# EAGLE design Vision (EAGLE 8.1.0)

## Sheet 1 of 3
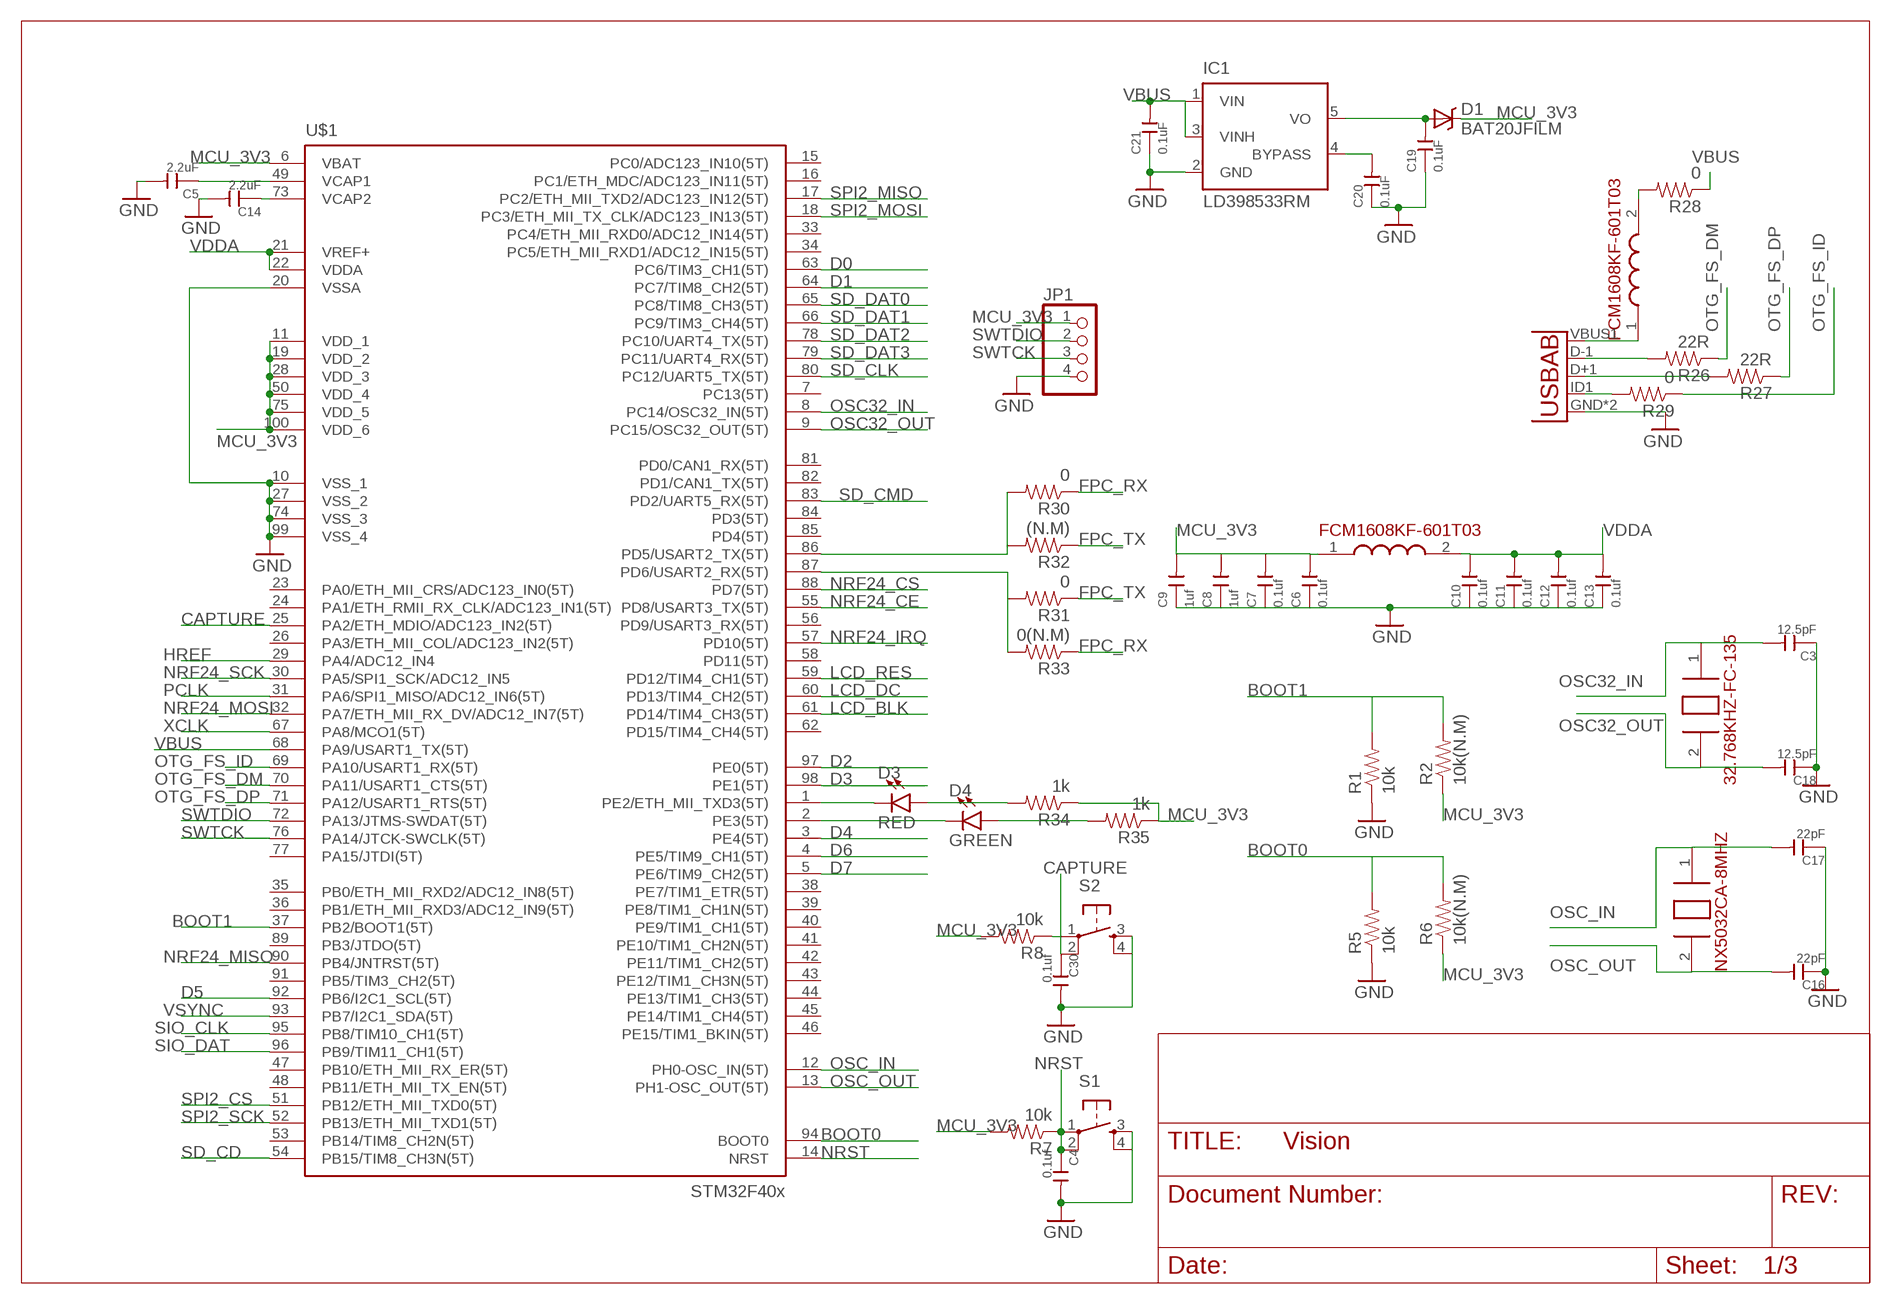
[diagram p0: schematic, sheet 1]

### Parts
C3  12.5pF  CERAMIC-4.7UF-10V-10%-X5R(0603)  [C0603]
C4  0.1uf  CERAMIC-4.7UF-10V-10%-X5R(0603)  [C0603]
C5  2.2uF  CERAMIC-0.5PF-50V-0.1PF-NPO(0603)  [C0603]
C6  0.1uf  CERAMIC-4.7UF-10V-10%-X5R(0603)  [C0603]
C7  0.1uf  CERAMIC-4.7UF-10V-10%-X5R(0603)  [C0603]
C8  1uf  CERAMIC-4.7UF-10V-10%-X5R(0603)  [C0603]
C9  1uf  CERAMIC-4.7UF-10V-10%-X5R(0603)  [C0603]
C10  0.1uf  CERAMIC-4.7UF-10V-10%-X5R(0603)  [C0603]
C11  0.1uf  CERAMIC-4.7UF-10V-10%-X5R(0603)  [C0603]
C12  0.1uf  CERAMIC-4.7UF-10V-10%-X5R(0603)  [C0603]
C13  0.1uf  CERAMIC-4.7UF-10V-10%-X5R(0603)  [C0603]
C14  2.2uF  CERAMIC-0.5PF-50V-0.1PF-NPO(0603)  [C0603]
C16  22pF  CERAMIC-4.7UF-10V-10%-X5R(0603)  [C0603]
C17  22pF  CERAMIC-4.7UF-10V-10%-X5R(0603)  [C0603]
C18  12.5pF  CERAMIC-4.7UF-10V-10%-X5R(0603)  [C0603]
C19  0.1uF  CERAMIC-0.5PF-50V-0.1PF-NPO(0603)  [C0603]
C20  0.1uF  CERAMIC-0.5PF-50V-0.1PF-NPO(0603)  [C0603]
C21  0.1uF  CERAMIC-0.5PF-50V-0.1PF-NPO(0603)  [C0603]
C30  0.1uf  CERAMIC-4.7UF-10V-10%-X5R(0603)  [C0603]
D1  BAT20JFILM  [SOD-323]
D3  RED  LED-BLUE0603  [LED-0603]
D4  GREEN  LED-BLUE0603  [LED-0603]
IC1  LD398533RM  [SOT23-5L]
JP1  PINHD-1X4  [1X04]
R1  10k  0OHM1/10W5%(0603)  [0603]
R2  10k(N.M)  0OHM1/10W5%(0603)  [0603]
R5  10k  0OHM1/10W5%(0603)  [0603]
R6  10k(N.M)  0OHM1/10W5%(0603)  [0603]
R7  10k  0OHM1/10W5%(0603)  [0603]
R8  10k  0OHM1/10W5%(0603)  [0603]
R26  22R  390OHM1/10W1%(0603)  [0603-RES]
R27  22R  390OHM1/10W1%(0603)  [0603-RES]
R28  0  390OHM1/10W1%(0603)  [0603-RES]
R29  0  390OHM1/10W1%(0603)  [0603-RES]
R30  0  0OHM1/10W5%(0603)  [0603]
R31  0  0OHM1/10W5%(0603)  [0603]
R32  (N.M)  0OHM1/10W5%(0603)  [0603]
R33  0(N.M)  0OHM1/10W5%(0603)  [0603]
R34  1k  0OHM1/10W5%(0603)  [0603]
R35  1k  0OHM1/10W5%(0603)  [0603]
S1  TAC_SWITCHSMD  [TACTILE_SWITCH_SMD]
S2  TAC_SWITCHSMD  [TACTILE_SWITCH_SMD]
U4  USB""  [USB-MICRO-SMD]
U$1  STM32F407V  [TQFP100]
U$2  NX5032CA-8MHZ  [NX5032CA-8MHZ]
U$3  FCM1608KF-601T03  [FCM1608KF-601T03]
U$4  32.768KHZ-FC-135  [32.768KHZ-FC-135]
U$5  FCM1608KF-601T03  [FCM1608KF-601T03]

### Nets
BOOT0: R5.2 R6.2 U$1.94(BOOT0)
BOOT1: R1.2 R2.2 U$1.37(PB2/BOOT1(5T))
CAPTURE: C30.1 R8.1 S2.1 S2.2 U$1.25(PA2/ETH_MDIO/ADC123_IN2(5T))
D0: U$1.63(PC6/TIM3_CH1(5T)) ; also sheet 2
D1: U$1.64(PC7/TIM8_CH2(5T)) ; also sheet 2
D2: U$1.97(PE0(5T)) ; also sheet 2
D3: U$1.98(PE1(5T)) ; also sheet 2
D4: U$1.3(PE4(5T)) ; also sheet 2
D5: U$1.92(PB6/I2C1_SCL(5T)) ; also sheet 2
D6: U$1.4(PE5/TIM9_CH1(5T)) ; also sheet 2
D7: U$1.5(PE6/TIM9_CH2(5T)) ; also sheet 2
FPC_RX: R30.1 R33.1 ; also sheet 3
FPC_TX: R31.1 R32.1 ; also sheet 3
GND: C3.1 C4.2 C5.2 C6.1 C7.1 C8.1 C9.1 C10.1 C11.1 C12.1 C13.1 C14.2 C16.1 C17.1 C18.1 C19.1 C20.1 C21.1 C30.2 IC1.2(GND) JP1.4 R1.1 R5.1 S1.3 S1.4 S2.3 S2.4 U4.GND U4.GND1(GND) U$1.10(VSS_1) U$1.20(VSSA) U$1.27(VSS_2) U$1.74(VSS_3) U$1.99(VSS_4) ; also sheet 2,3
HREF: U$1.29(PA4/ADC12_IN4) ; also sheet 2
LCD_BLK: U$1.61(PD14/TIM4_CH3(5T)) ; also sheet 3
LCD_DC: U$1.60(PD13/TIM4_CH2(5T)) ; also sheet 3
LCD_RES: U$1.59(PD12/TIM4_CH1(5T)) ; also sheet 3
MCU_3V3: C6.2 C7.2 C8.2 C9.2 D1.1(C) JP1.1 R2.1 R6.1 R7.2 R8.2 R34.1 R35.1 U$1.6(VBAT) U$1.11(VDD_1) U$1.19(VDD_2) U$1.28(VDD_3) U$1.50(VDD_4) U$1.75(VDD_5) U$1.100(VDD_6) U$3.1(1.IN) ; also sheet 2,3
N$2: D3.C U$1.1(PE2/ETH_MII_TXD3(5T))
N$3: D4.C U$1.2(PE3(5T))
N$10: D3.A R34.2
N$11: C5.1 U$1.49(VCAP1)
N$12: C14.1 U$1.73(VCAP2)
N$14: D4.A R35.2
N$18: C20.2 IC1.4(BYPASS)
N$25: R26.2 U4.D-1(D-)
N$30: C19.2 D1.2(A) IC1.5(VO)
N$31: R27.2 U4.D+1(D+)
N$32: U4.VBUS1(VBUS) U$5.1(1.IN)
N$33: R29.2 U4.ID1(USBID)
N$34: R28.2 U$5.2(2.OUT)
NRF24_CE: U$1.55(PD8/USART3_TX(5T)) ; also sheet 3
NRF24_CS: U$1.88(PD7(5T)) ; also sheet 3
NRF24_IRQ: U$1.57(PD10(5T)) ; also sheet 3
NRF24_MISO: U$1.90(PB4/JNTRST(5T)) ; also sheet 3
NRF24_MOSI: U$1.32(PA7/ETH_MII_RX_DV/ADC12_IN7(5T)) ; also sheet 3
NRF24_SCK: U$1.30(PA5/SPI1_SCK/ADC12_IN5) ; also sheet 3
NRST: C4.1 R7.1 S1.1 S1.2 U$1.14(NRST)
OSC32_IN: C3.2 U$1.8(PC14/OSC32_IN(5T)) U$4.1(1.XIN)
OSC32_OUT: C18.2 U$1.9(PC15/OSC32_OUT(5T)) U$4.2(2.XIN)
OSC_IN: C17.2 U$1.12(PH0-OSC_IN(5T)) U$2.1(1.XIN)
OSC_OUT: C16.2 U$1.13(PH1-OSC_OUT(5T)) U$2.2(2.XOUT)
OTG_FS_DM: R26.1 U$1.70(PA11/USART1_CTS(5T))
OTG_FS_DP: R27.1 U$1.71(PA12/USART1_RTS(5T))
OTG_FS_ID: R29.1 U$1.69(PA10/USART1_RX(5T))
PCLK: U$1.31(PA6/SPI1_MISO/ADC12_IN6(5T)) ; also sheet 2
SD_CD: U$1.54(PB15/TIM8_CH3N(5T)) ; also sheet 3
SD_CLK: U$1.80(PC12/UART5_TX(5T)) ; also sheet 3
SD_CMD: U$1.83(PD2/UART5_RX(5T)) ; also sheet 3
SD_DAT0: U$1.65(PC8/TIM8_CH3(5T)) ; also sheet 3
SD_DAT1: U$1.66(PC9/TIM3_CH4(5T)) ; also sheet 3
SD_DAT2: U$1.78(PC10/UART4_TX(5T)) ; also sheet 3
SD_DAT3: U$1.79(PC11/UART4_RX(5T)) ; also sheet 3
SIO_CLK: U$1.95(PB8/TIM10_CH1(5T)) ; also sheet 2
SIO_DAT: U$1.96(PB9/TIM11_CH1(5T)) ; also sheet 2
SPI2_CS: U$1.51(PB12/ETH_MII_TXD0(5T)) ; also sheet 3
SPI2_MISO: U$1.17(PC2/ETH_MII_TXD2/ADC123_IN12(5T)) ; also sheet 3
SPI2_MOSI: U$1.18(PC3/ETH_MII_TX_CLK/ADC123_IN13(5T)) ; also sheet 3
SPI2_SCK: U$1.52(PB13/ETH_MII_TXD1(5T)) ; also sheet 3
SWTCK: JP1.3 U$1.76(PA14/JTCK-SWCLK(5T))
SWTDIO: JP1.2 U$1.72(PA13/JTMS-SWDAT(5T))
UART2_RX: R31.2 R33.2 U$1.87(PD6/USART2_RX(5T))
UART2_TX: R30.2 R32.2 U$1.86(PD5/USART2_TX(5T))
VBUS: C21.2 IC1.1(VIN) IC1.3(VINH) R28.1 U$1.68(PA9/USART1_TX(5T))
VDDA: C10.2 C11.2 C12.2 C13.2 U$1.21(VREF+) U$1.22(VDDA) U$3.2(2.OUT)
VSYNC: U$1.93(PB7/I2C1_SDA(5T)) ; also sheet 2
XCLK: U$1.67(PA8/MCO1(5T)) ; also sheet 2
Unconnected: U$1.7(PC13(5T)) U$1.15(PC0/ADC123_IN10(5T)) U$1.16(PC1/ETH_MDC/ADC123_IN11(5T)) U$1.23(PA0/ETH_MII_CRS/ADC123_IN0(5T)) U$1.24(PA1/ETH_RMII_RX_CLK/ADC123_IN1(5T)) U$1.26(PA3/ETH_MII_COL/ADC123_IN2(5T)) U$1.33(PC4/ETH_MII_RXD0/ADC12_IN14(5T)) U$1.34(PC5/ETH_MII_RXD1/ADC12_IN15(5T)) U$1.35(PB0/ETH_MII_RXD2/ADC12_IN8(5T)) U$1.36(PB1/ETH_MII_RXD3/ADC12_IN9(5T)) U$1.38(PE7/TIM1_ETR(5T)) U$1.39(PE8/TIM1_CH1N(5T)) U$1.40(PE9/TIM1_CH1(5T)) U$1.41(PE10/TIM1_CH2N(5T)) U$1.42(PE11/TIM1_CH2(5T)) U$1.43(PE12/TIM1_CH3N(5T)) U$1.44(PE13/TIM1_CH3(5T)) U$1.45(PE14/TIM1_CH4(5T)) U$1.46(PE15/TIM1_BKIN(5T)) U$1.47(PB10/ETH_MII_RX_ER(5T)) U$1.48(PB11/ETH_MII_TX_EN(5T)) U$1.53(PB14/TIM8_CH2N(5T)) U$1.56(PD9/USART3_RX(5T)) U$1.58(PD11(5T)) U$1.62(PD15/TIM4_CH4(5T)) U$1.77(PA15/JTDI(5T)) U$1.81(PD0/CAN1_RX(5T)) U$1.82(PD1/CAN1_TX(5T)) U$1.84(PD3(5T)) U$1.85(PD4(5T)) U$1.89(PB3/JTDO(5T)) U$1.91(PB5/TIM3_CH2(5T))

## Sheet 2 of 3
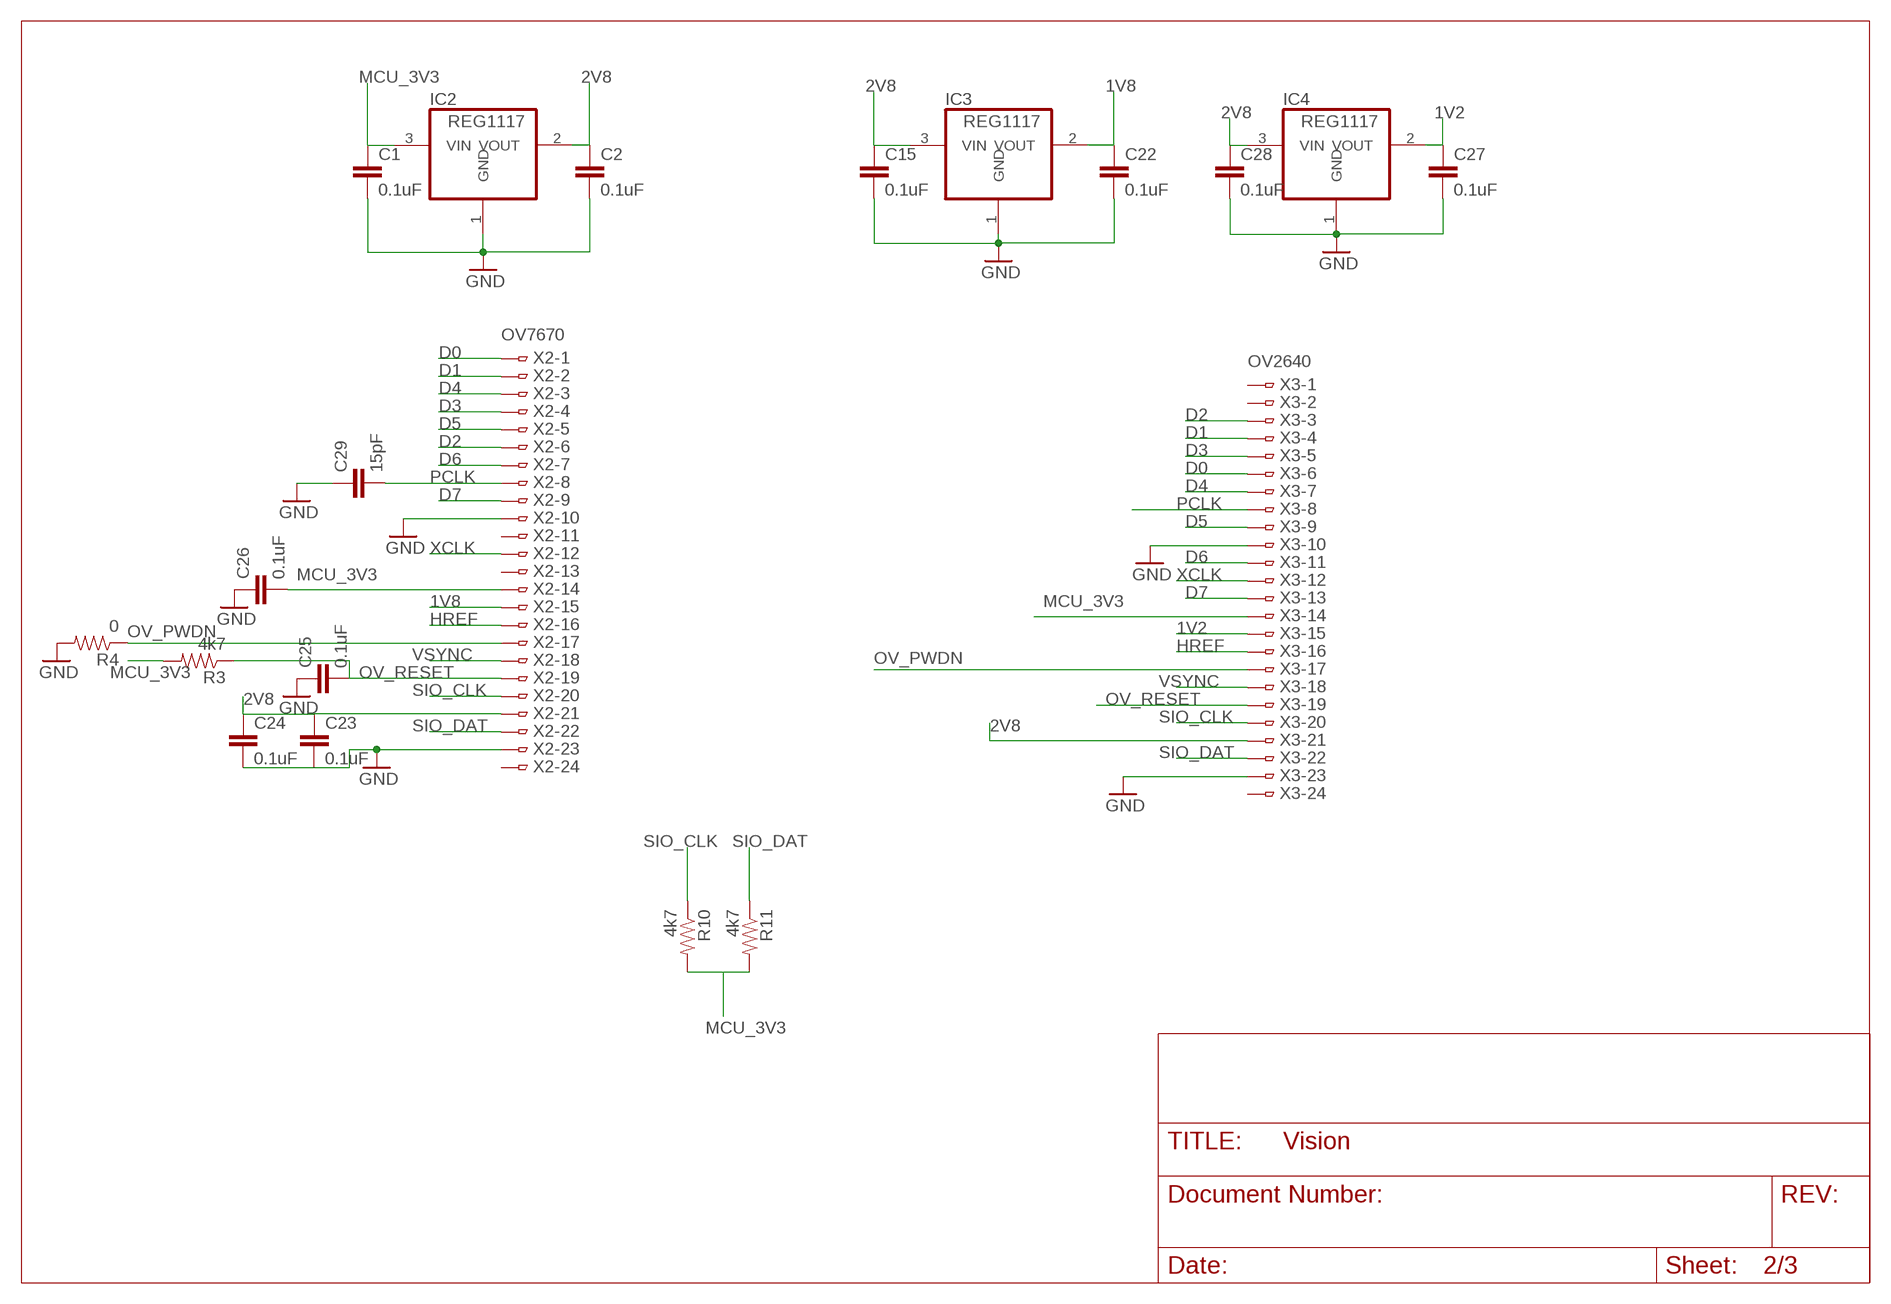
[diagram p1: schematic, sheet 2]

### Parts
C1  0.1uF  1.0UF-25V-+80/-20(0805)  [0805]
C2  0.1uF  1.0UF-25V-+80/-20(0805)  [0805]
C15  0.1uF  1.0UF-25V-+80/-20(0805)  [0805]
C22  0.1uF  1.0UF-25V-+80/-20(0805)  [0805]
C23  0.1uF  1.0UF-25V-+80/-20(0805)  [0805]
C24  0.1uF  1.0UF-25V-+80/-20(0805)  [0805]
C25  0.1uF  1.0UF-25V-+80/-20(0805)  [0805]
C26  0.1uF  1.0UF-25V-+80/-20(0805)  [0805]
C27  0.1uF  1.0UF-25V-+80/-20(0805)  [0805]
C28  0.1uF  1.0UF-25V-+80/-20(0805)  [0805]
C29  15pF  1.0UF-25V-+80/-20(0805)  [0805]
IC2  REG1117  [SOT223]
IC3  REG1117  [SOT223]
IC4  REG1117  [SOT223]
R3  4k7  0OHM1/10W5%(0603)  [0603]
R4  0  0OHM1/10W5%(0603)  [0603]
R10  4k7  0OHM1/10W5%(0603)  [0603]
R11  4k7  0OHM1/10W5%(0603)  [0603]
X2  OV7670  FH12-24S-0.5SH  [FH12-24S-0.5SH]
X3  OV2640  FH12-24S-0.5SH  [FH12-24S-0.5SH]

### Nets
1V2: C27.1 IC4.2(VOUT) X3.15
1V8: C22.1 IC3.2(VOUT) X2.15
2V8: C2.1 C15.1 C23.1 C24.1 C28.1 IC2.2(VOUT) IC3.3(VIN) IC4.3(VIN) X2.21 X3.21
D0: X2.1 X3.6 ; also sheet 1
D1: X2.2 X3.4 ; also sheet 1
D2: X2.6 X3.3 ; also sheet 1
D3: X2.4 X3.5 ; also sheet 1
D4: X2.3 X3.7 ; also sheet 1
D5: X2.5 X3.9 ; also sheet 1
D6: X2.7 X3.11 ; also sheet 1
D7: X2.9 X3.13 ; also sheet 1
GND: C1.2 C2.2 C15.2 C22.2 C23.2 C24.2 C25.1 C26.1 C27.2 C28.2 C29.1 IC2.1(GND) IC3.1(GND) IC4.1(GND) R4.2 X2.10 X2.23 X3.10 X3.23 ; also sheet 1,3
HREF: X2.16 X3.16 ; also sheet 1
MCU_3V3: C1.1 C26.2 IC2.3(VIN) R3.2 R10.2 R11.2 X2.14 X3.14 ; also sheet 1,3
OV_PWDN: R4.1 X2.17 X3.17
OV_RESET: C25.2 R3.1 X2.19 X3.19
PCLK: C29.2 X2.8 X3.8 ; also sheet 1
SIO_CLK: R10.1 X2.20 X3.20 ; also sheet 1
SIO_DAT: R11.1 X2.22 X3.22 ; also sheet 1
VSYNC: X2.18 X3.18 ; also sheet 1
XCLK: X2.12 X3.12 ; also sheet 1
Unconnected: X2.11 X2.13 X2.24 X3.1 X3.2 X3.24

## Sheet 3 of 3
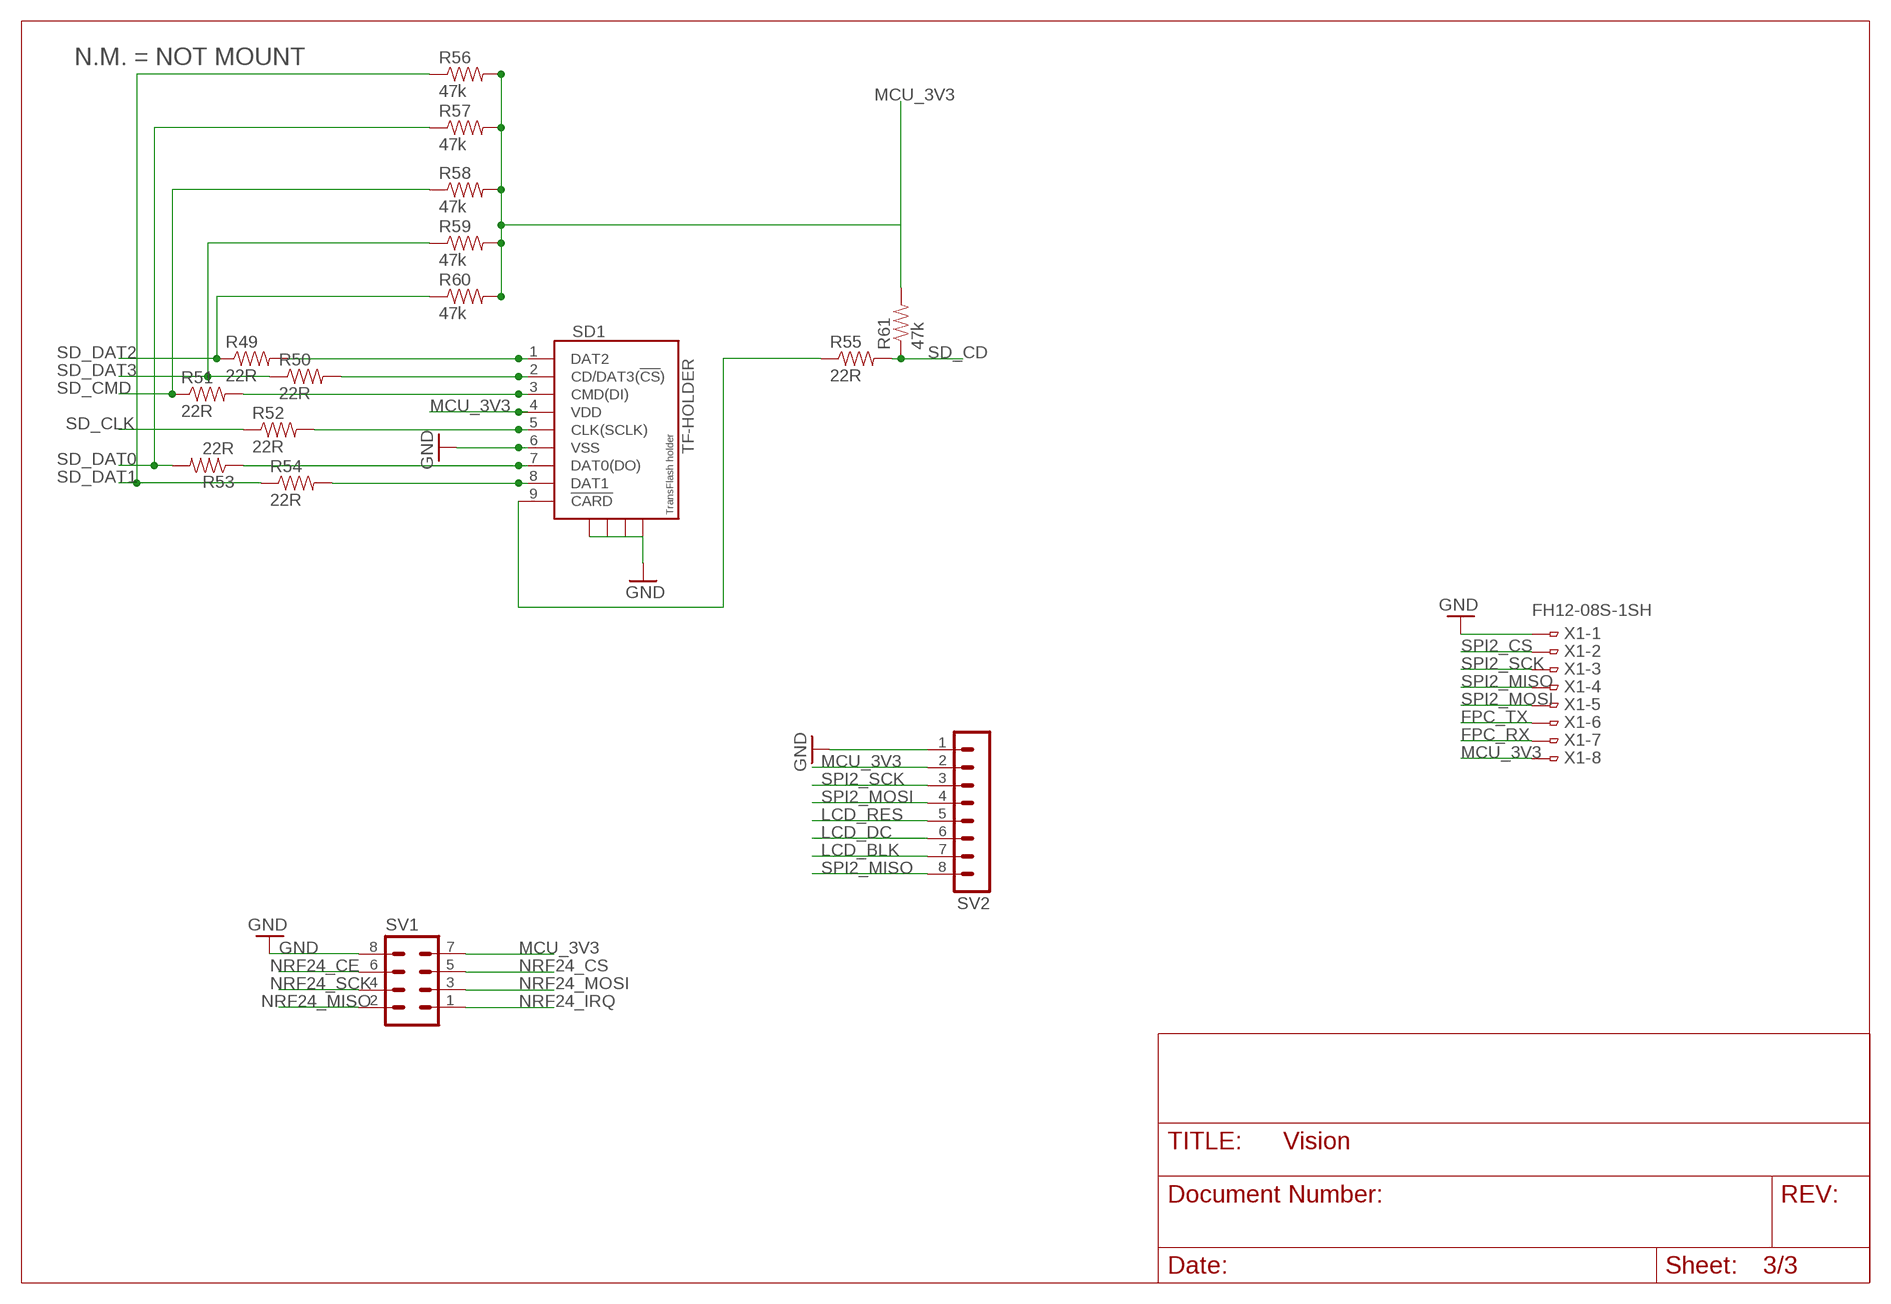
[diagram p2: schematic, sheet 3]

### Parts
R49  22R  100OHM1/10W1%(0603)  [0603-RES]
R50  22R  100OHM1/10W1%(0603)  [0603-RES]
R51  22R  100OHM1/10W1%(0603)  [0603-RES]
R52  22R  100OHM1/10W1%(0603)  [0603-RES]
R53  22R  100OHM1/10W1%(0603)  [0603-RES]
R54  22R  100OHM1/10W1%(0603)  [0603-RES]
R55  22R  100OHM1/10W1%(0603)  [0603-RES]
R56  47k  100OHM1/10W1%(0603)  [0603-RES]
R57  47k  100OHM1/10W1%(0603)  [0603-RES]
R58  47k  100OHM1/10W1%(0603)  [0603-RES]
R59  47k  100OHM1/10W1%(0603)  [0603-RES]
R60  47k  100OHM1/10W1%(0603)  [0603-RES]
R61  47k  100OHM1/10W1%(0603)  [0603-RES]
SD1  TF-HOLDER  [TF-PULL]
SV1  MA04-2  [MA04-2]
SV2  MA08-1  [MA08-1]
X1  FH12-08S-1SH  [FH12-08S-1SH]

### Nets
FPC_RX: X1.7 ; also sheet 1
FPC_TX: X1.6 ; also sheet 1
GND: SD1.6(VSS) SD1.S1 SD1.S2 SD1.S3 SD1.S4 SV1.8 SV2.1 X1.1 ; also sheet 1,2
LCD_BLK: SV2.7 ; also sheet 1
LCD_DC: SV2.6 ; also sheet 1
LCD_RES: SV2.5 ; also sheet 1
MCU_3V3: R56.2 R57.2 R58.2 R59.2 R60.2 R61.2 SD1.4(VDD) SV1.7 SV2.2 X1.8 ; also sheet 1,2
N$6: R49.2 SD1.1(DAT2)
N$51: R50.2 SD1.2(CD/DAT3(!CS!))
N$52: R51.2 SD1.3(CMD(DI))
N$53: R52.2 SD1.5(CLK(SCLK))
N$54: R53.1 SD1.7(DAT0(DO))
N$55: R54.2 SD1.8(DAT1)
N$56: R55.1 SD1.9(!CARD)
NRF24_CE: SV1.6 ; also sheet 1
NRF24_CS: SV1.5 ; also sheet 1
NRF24_IRQ: SV1.1 ; also sheet 1
NRF24_MISO: SV1.2 ; also sheet 1
NRF24_MOSI: SV1.3 ; also sheet 1
NRF24_SCK: SV1.4 ; also sheet 1
SD_CD: R55.2 R61.1 ; also sheet 1
SD_CLK: R52.1 ; also sheet 1
SD_CMD: R51.1 R58.1 ; also sheet 1
SD_DAT0: R53.2 R57.1 ; also sheet 1
SD_DAT1: R54.1 R56.1 ; also sheet 1
SD_DAT2: R49.1 R60.1 ; also sheet 1
SD_DAT3: R50.1 R59.1 ; also sheet 1
SPI2_CS: X1.2 ; also sheet 1
SPI2_MISO: SV2.8 X1.4 ; also sheet 1
SPI2_MOSI: SV2.4 X1.5 ; also sheet 1
SPI2_SCK: SV2.3 X1.3 ; also sheet 1

### Notes on the sheet
- N.M. = NOT MOUNT

## Library data of the parts
C1 C2 C15 C22-C29 = SparkFun-Capacitors:1.0UF-25V-+80/-20(0805); PROD_ID: CAP-11625; VALUE: 1.0uF
C3 C4 C6-C13 C16-C18 C30 = Seeed-OPL-Capacitor:CERAMIC-4.7UF-10V-10%-X5R(0603): 302010111; MPN: CC0603KRX5R6BB475; VALUE: 4.7uf
C5 C14 C19-C21 = Seeed-OPL-Capacitor:CERAMIC-0.5PF-50V-0.1PF-NPO(0603): 302010115; VALUE: 0.5PF 50V
D1 = SparkFun-DiscreteSemi:BAT20JFILM: 23V, 1A Schottky diode, SOD-323 package; PROD_ID: DIO-11623
D3 D4 = SparkFun-LED:LED-BLUE: Blue SMD LED Used in manufacturing of various products at SparkFun Packages: 0603 - SMD 0603 package [Product Link] <http://www.digikey.com/product-detail/en/SMLE12BC7TT86/511-1589-2-ND/1641808> 1206 - SMD1206 package [Product Link] <http://www.digikey.com/product-detail/en/lite-on-inc/LTST-C150TBKT/160-1643-1-ND/573584> SparkFun Products: ESP8266 Thing-Dev Board <https://www.sparkfun.com/products/13711> RedBoard <https://www.sparkfun.com/products/12757>; PROD_ID: DIO-08575; VALUE: BLUE
IC1 = st-microelectronics:LD3985: Ultra low drop and low noise BiCMOS voltage regulators Source: www.st.com LD3985.pdf
IC2-IC4 = burr-brown:REG1117: 800mA and 1A Low Dropout (LDO) Positive Regulator 1.8V, 2.5V, 2.85V, 3.3V, 5V, and Adj; MPN: REG1117; OC_FARNELL: 1097566; OC_NEWARK: 14P6981
JP1 = pinhead:PINHD-1X4: PIN HEADER
R1-R3 R5-R8 R10 R11 R32-R35 = SparkFun-Resistors:0OHM1/10W5%(0603): RES-08609; PROD_ID: RES-08609; VALUE: 0
R4 R30 R31 = SparkFun-Resistors:0OHM1/10W5%(0603): RES-08609; PROD_ID: RES-08609
R26-R29 = SparkFun-Resistors:390OHM1/10W1%(0603): RES-07864; PROD_ID: RES-07864; VALUE: 390
R49-R61 = SparkFun-Resistors:100OHM1/10W1%(0603): RES-07863; PROD_ID: RES-07863; VALUE: 100
S1 S2 = SparkFun-Electromechanical:TAC_SWITCH: Momentary Switch Button commonly used for reset or general input. Spark Fun Electronics SKU : COM-00097 SMT- SWCH-08247; PROD_ID: SWCH-08247
SD1 = sd-mmc:TF-HOLDER: TF / Micro SD socket is PUSH-PUSH type, the card can be pushed into and auto locked and pushed out by simply press the card. Surface Mounting type.
SV1 = con-lstb:MA04-2: PIN HEADER; OC_FARNELL: unknown; OC_NEWARK: unknown
SV2 = con-lstb:MA08-1: PIN HEADER; OC_FARNELL: unknown; OC_NEWARK: unknown
U4 = MicroUSB Long GND:USB: This is a USB AB connector that is compatible with USB OTG. i.e. this connector can serve as a host or device
U$1 = stm32f4:STM32F407V: STM32F407 100 pin LQFP reviewed: YES tested: YES
U$2 = NX5032CA-8MHZ:NX5032CA-8MHZ
U$3 U$5 = FCM1608KF-601T03:FCM1608KF-601T03
U$4 = 32.768KHZ-FC-135:32.768KHZ-FC-135
X1 = con-hirose:FH12-08S-1S: 1mm Pitch Connectors For FPC/FFC Source: Data sheet <http://www.hirose.co.jp/cataloge_hp/e58605370.pdf>; OC_FARNELL: unknown; OC_NEWARK: unknown
X2 X3 = con-hirose:FH12-24S-0.5S: 0.5mm Pitch Connectors For FPC/FFC Source: Data sheet <http://www.hirose.co.jp/cataloge_hp/e58605370.pdf>; MPN: FH12-24S-0.5SH(55); OC_FARNELL: 1324552; OC_NEWARK: 34M6170

## Board
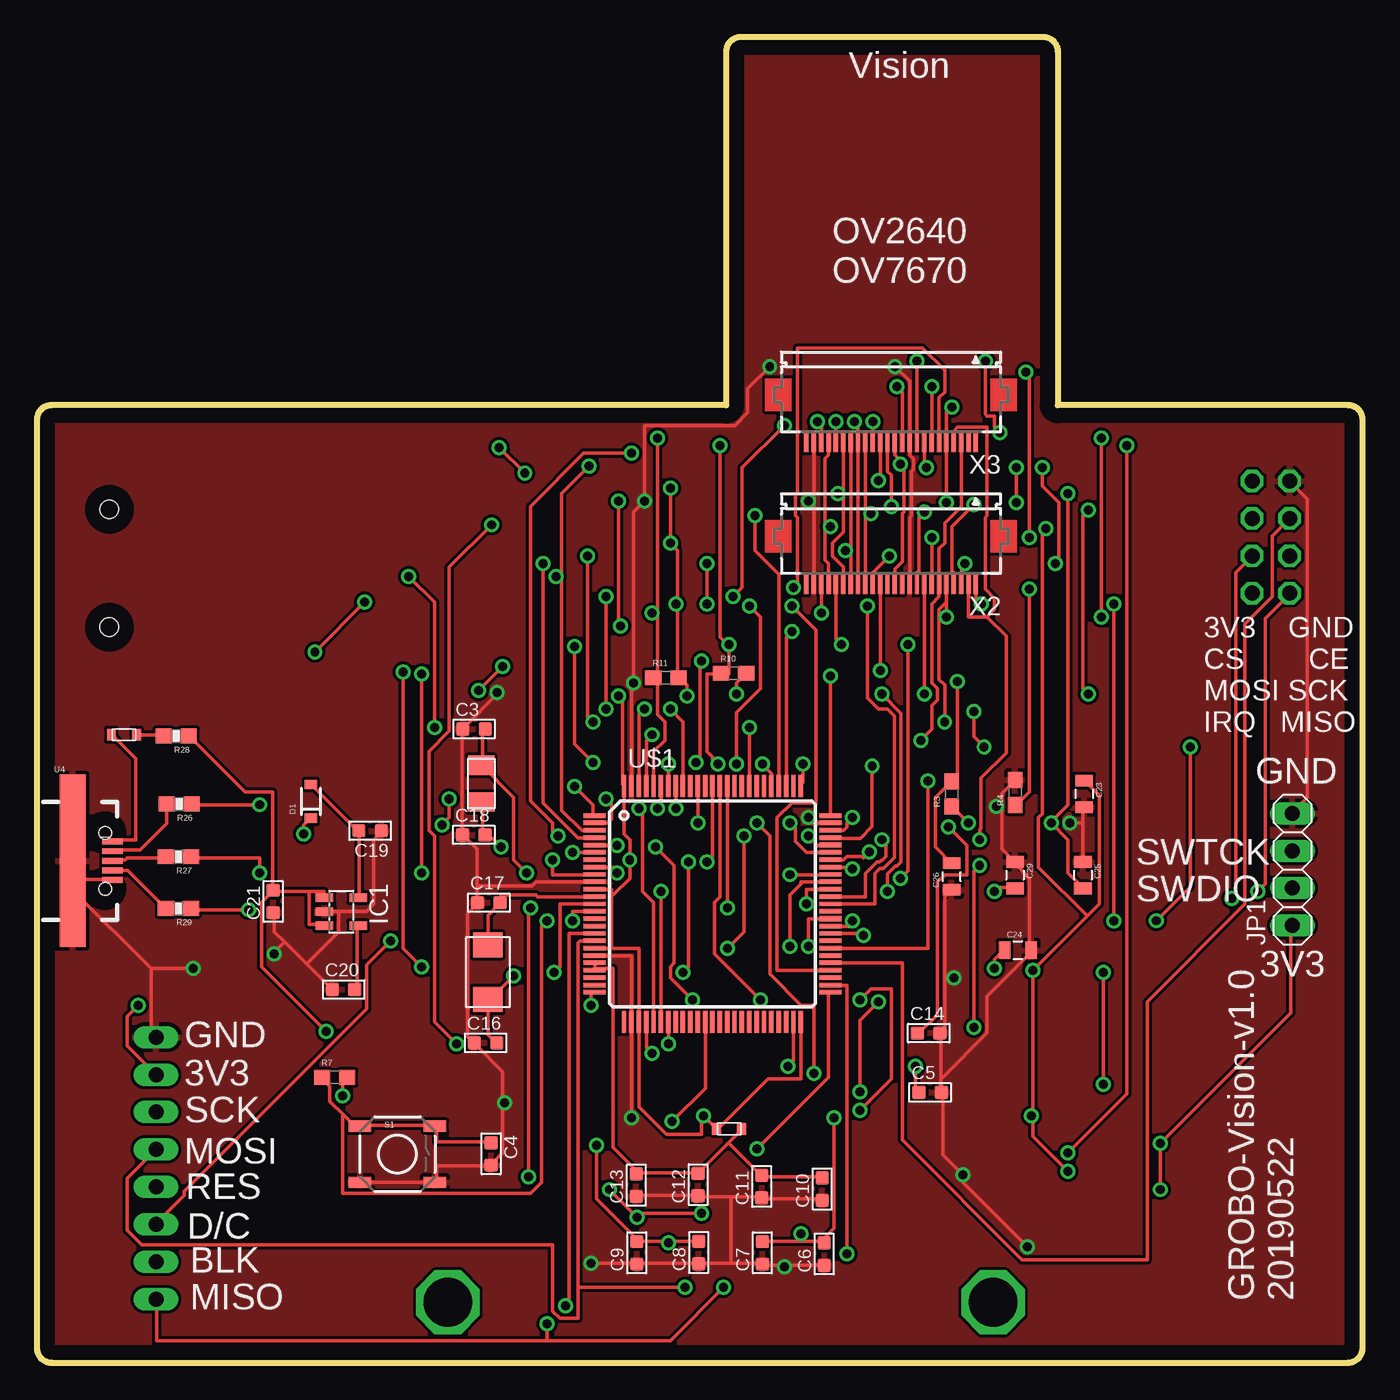
[diagram p3: board, top side]
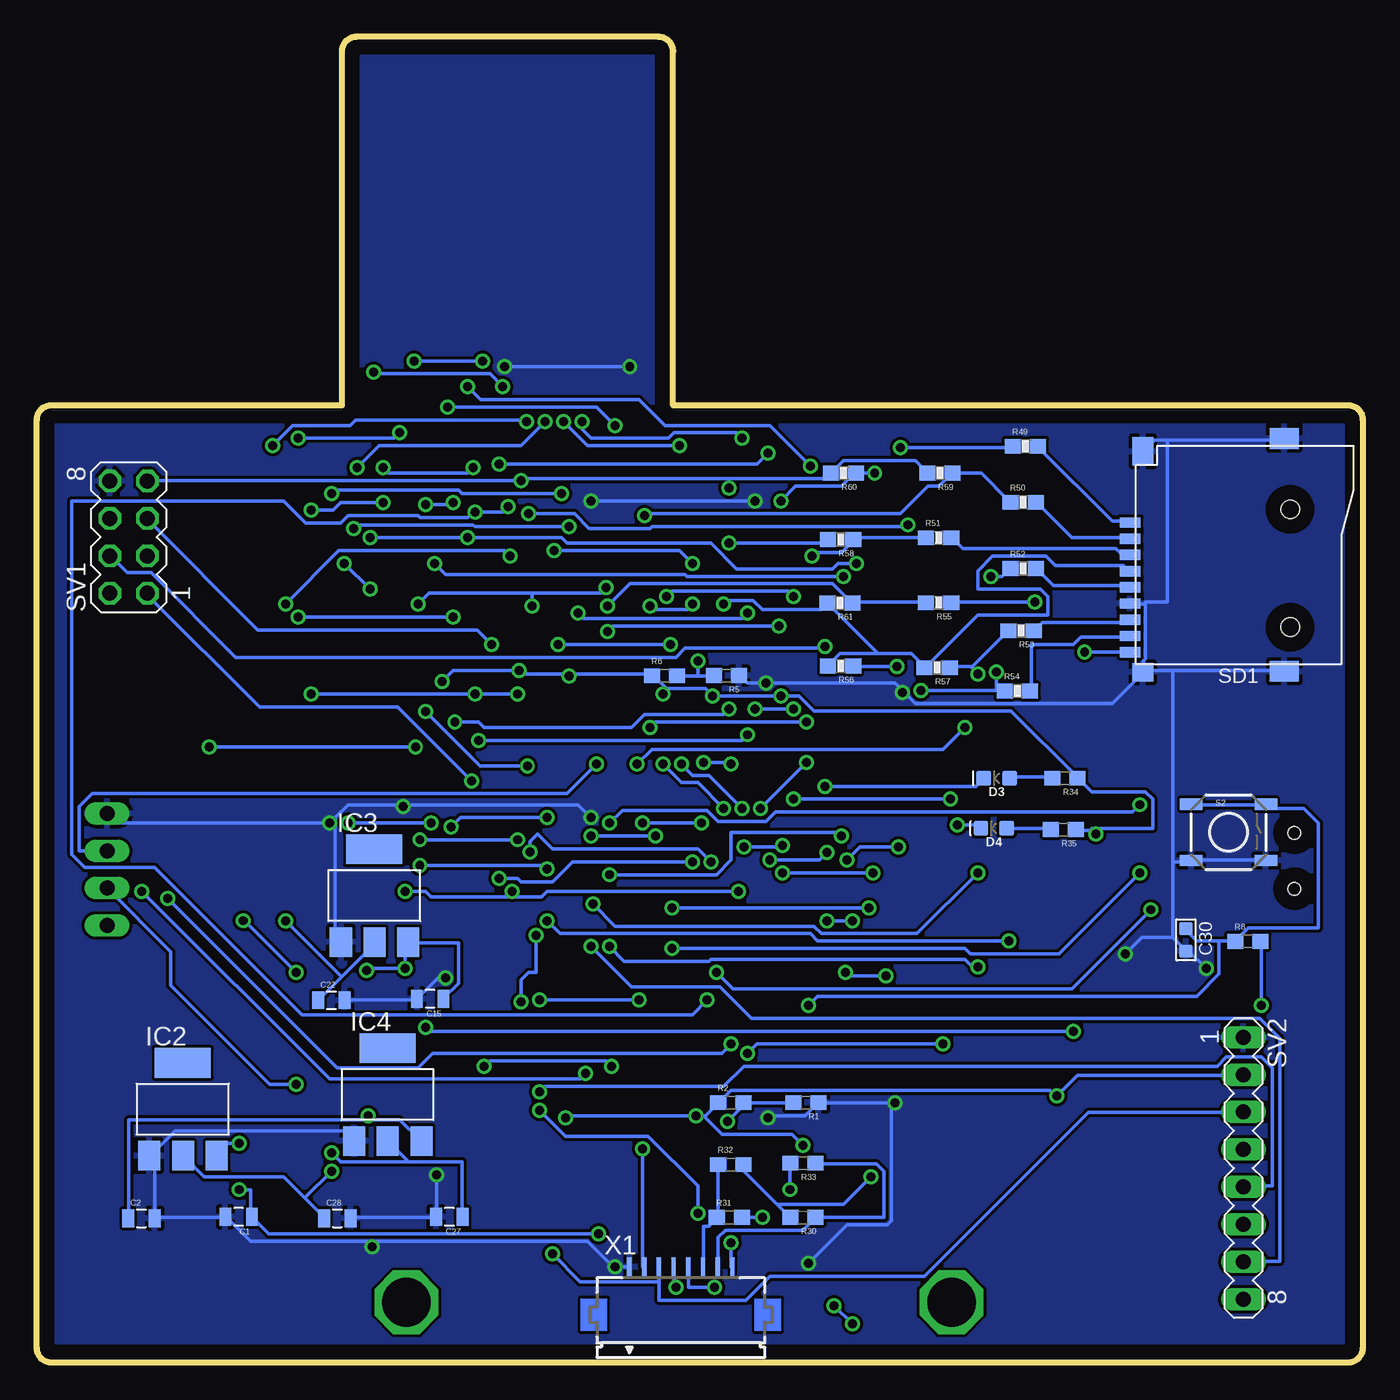
[diagram p4: board, bottom side, seen from below]

Size 90 x 90 mm. Coordinates in mm from the lower left corner, seen from the top.
Outline: 46.8,65 1,65 arc90 0,64 0,1 arc90 1,0 89,0 arc90 90,1 90,64 arc90 89,65 69.3,65 69.3,89 arc90 68.3,90 47.8,90 arc90 46.8,89 46.8,65
Copper layers (1*16): Top 0.035mm / dielectric 1.5mm / Bottom 0.035mm
Design rules "default": minimum track width 10mil, minimum drill 24mil, track to track 8mil, track to pad 8mil, pad to pad 8mil, via to via 8mil, smd to smd 8mil, copper to edge 40mil, drill to drill 8mil, minimum pad ring 10mil, minimum via ring 8mil, stop-mask expansion 4mil, vias tented up to drill 0mil, thermal gap 10mil

### Footprints (pad centres in the part's own frame; a part is rotated, then mirrored left to right if it is on the bottom)
0805 = smd 0.8 x 1.2: 1 -0.9,0; 2 0.9,0
C0603 = smd 0.889 x 0.889: 1 0,0.762; 2 0,-0.762
SOD-323 = smd 0.63 x 0.83: 1 -1.15,0; 2 1.15,0
LED-0603 = smd 1 x 1: A -0.877,0; C 0.877,0
SOT23-5L = smd 0.6 x 1.2: 1 -0.95,-1.15; 2 0,-1.15; 3 0.95,-1.15; 4 0.95,1.15; 5 -0.95,1.15
SOT223 = smd 1.499 x 2.007: 1 -2.261,-3.15; 2 0.025,-3.15; 3 2.311,-3.15 | smd 3.81 x 2.007: 4 0,3.15
1X04 = drill 1.016 long: 1 -3.81,0; 2 -1.27,0; 3 1.27,0; 4 3.81,0
0603 = smd 1.1 x 1: 1 -0.85,0; 2 0.85,0
0603-RES = smd 1.1 x 1: 1 -0.85,0; 2 0.85,0
TACTILE_SWITCH_SMD = smd 1.524 x 0.762: 1 -2.54,1.905; 2 2.54,1.905; 3 -2.54,-1.905; 4 2.54,-1.905
TF-PULL = smd 0.7 x 1.4: 1 -2.2,-7.62; 2 -1.1,-7.62; 3 0,-7.62; 4 1.1,-7.62; 5 2.2,-7.62; 6 3.3,-7.62; 7 4.4,-7.62; 8 5.5,-7.62; 9 6.6,-7.62 | smd 1.4 x 2: S1 -7.9,2.85; S2 7.9,2.85 | smd 1.28 x 1.4: S3 7.96,-6.75 | smd 1.95 x 1.4: S4 -7.025,-6.75 | hole 1.25: -3.1,3.25; 4.9,3.25
MA04-2 = drill 1.016 octagon: 1 -3.81,-1.27; 2 -3.81,1.27; 3 -1.27,-1.27; 4 -1.27,1.27; 5 1.27,-1.27; 6 1.27,1.27; 7 3.81,-1.27; 8 3.81,1.27
MA08-1 = drill 1.016 long: 1 -8.89,0; 2 -6.35,0; 3 -3.81,0; 4 -1.27,0; 5 1.27,0; 6 3.81,0; 7 6.35,0; 8 8.89,0
USB-MICRO-SMD = smd 1.4 x 0.4: D+1 2.7,0; D-1 2.7,0.65; GND1 2.7,-1.3; ID1 2.7,-0.65; VBUS1 2.7,1.3 | smd 1.778 x 11.684: GND 0,0 | hole 0.85: 2.2,1.9; 2.2,-1.9
TQFP100 = smd 1.5 x 0.3: 1 -8,6; 2 -8,5.5; 3 -8,5; 4 -8,4.5; 5 -8,4; 6 -8,3.5; 7 -8,3; 8 -8,2.5; 9 -8,2; 10 -8,1.5; 11 -8,1; 12 -8,0.5; 13 -8,0; 14 -8,-0.5; 15 -8,-1; 16 -8,-1.5; 17 -8,-2; 18 -8,-2.5; 19 -8,-3; 20 -8,-3.5; 21 -8,-4; 22 -8,-4.5; 23 -8,-5; 24 -8,-5.5; 25 -8,-6; 51 8,-6; 52 8,-5.5; 53 8,-5; 54 8,-4.5; 55 8,-4; 56 8,-3.5; 57 8,-3; 58 8,-2.5; 59 8,-2; 60 8,-1.5; 62 8,-0.5; 63 8,0; 64 8,0.5; 65 8,1; 66 8,1.5; 67 8,2; 68 8,2.5; 69 8,3; 70 8,3.5; 72 8,4.5; 73 8,5; 74 8,5.5; 75 8,6 | smd 0.3 x 1.5: 26 -6,-8; 27 -5.5,-8; 28 -5,-8; 29 -4.5,-8; 30 -4,-8; 31 -3.5,-8; 32 -3,-8; 33 -2.5,-8; 34 -2,-8; 35 -1.5,-8; 36 -1,-8; 37 -0.5,-8; 38 0,-8; 39 0.5,-8; 40 1,-8; 41 1.5,-8; 42 2,-8; 43 2.5,-8; 44 3,-8; 45 3.5,-8; 46 4,-8; 47 4.5,-8; 48 5,-8; 49 5.5,-8; 50 6,-8; 76 6,8; 77 5.5,8; 78 5,8; 79 4.5,8; 80 4,8; 81 3.5,8; 82 3,8; 83 2.5,8; 84 2,8; 85 1.5,8; 86 1,8; 87 0.5,8; 88 0,8; 89 -0.5,8; 90 -1,8; 91 -1.5,8; 92 -2,8; 93 -2.5,8; 94 -3,8; 95 -3.5,8; 96 -4,8; 97 -4.5,8; 98 -5,8; 99 -5.5,8; 100 -6,8 | smd 1.5 x 0.35: 61 8,-1; 71 8,4
NX5032CA-8MHZ = smd 1.7 x 2: 1 0,0; 2 3.7,0
FCM1608KF-601T03 = smd 0.6 x 0.8: 1 -0.05,0.4; 2 1.65,0.4
32.768KHZ-FC-135 = smd 1.3 x 1.8: 1 0,0; 2 2.5,0
FH12-08S-1SH = smd 0.3 x 1.3: 1 -3.5,3.25; 2 -2.5,3.25; 3 -1.5,3.25; 4 -0.5,3.25; 5 0.5,3.25; 6 1.5,3.25; 7 2.5,3.25; 8 3.5,3.25
FH12-24S-0.5SH = smd 0.3 x 1.3: 1 -5.75,3.25; 2 -5.25,3.25; 3 -4.75,3.25; 4 -4.25,3.25; 5 -3.75,3.25; 6 -3.25,3.25; 7 -2.75,3.25; 8 -2.25,3.25; 9 -1.75,3.25; 10 -1.25,3.25; 11 -0.75,3.25; 12 -0.25,3.25; 13 0.25,3.25; 14 0.75,3.25; 15 1.25,3.25; 16 1.75,3.25; 17 2.25,3.25; 18 2.75,3.25; 19 3.25,3.25; 20 3.75,3.25; 21 4.25,3.25; 22 4.75,3.25; 23 5.25,3.25; 24 5.75,3.25

### Placement (x,y rotation side)
C1  76.3,9.9 180 bottom
C2  82.9,9.8 0 bottom
C3  29.68,43.01 90 top
C4  30.84,14.17 0 top
C5  60.64,18.35 90 top
C6  53.45,7.38 180 top
C7  49.25,7.46 180 top
C8  44.93,7.48 180 top
C9  40.73,7.46 180 top
C10  53.31,11.78 180 top
C11  49.21,11.96 180 top
C12  44.89,12.08 180 top
C13  40.69,12.06 180 top
C14  60.54,22.37 90 top
C15  63.3,24.7 180 bottom
C16  30.46,21.71 90 top
C17  30.68,31.23 90 top
C18  29.66,35.83 90 top
C19  22.62,36.11 270 top
C20  20.82,25.33 90 top
C21  16.04,31.31 180 top
C22  70,24.6 0 bottom
C23  71.1,38.6 270 top
C24  66.6,28 0 top
C25  71,33.1 270 top
C26  62.1,33 90 top
C27  62,9.9 180 bottom
C28  69.6,9.8 0 bottom
C29  66.4,33.1 270 top
C30  12,28.7 0 bottom
D1  18.61,38.1 90 top
D3  24.85,39.67 180 bottom
D4  25.04,36.27 180 bottom
IC1  20.67,30.61 270 top
IC2  80.1,17.2 0 bottom
IC3  67.1,31.7 0 bottom
IC4  66.2,18.2 0 bottom
JP1  85.23,33.48 90 top
R1  37.79,17.66 180 bottom
R2  42.89,17.65 0 bottom
R3  62.1,38.6 90 top
R4  66.4,38.7 90 top
R5  43.19,46.64 180 bottom
R6  47.39,46.63 0 bottom
R7  20.22,19.37 0 top
R8  7.8,28.6 0 bottom
R10  47.3,46.8 0 top
R11  42.7,46.5 0 top
R26  9.66,37.92 180 top
R27  9.61,34.34 180 top
R28  9.46,42.54 180 top
R29  9.61,30.83 180 top
R30  37.99,9.87 180 bottom
R31  42.99,9.86 0 bottom
R32  42.89,13.45 0 bottom
R33  37.99,13.54 180 bottom
R34  20.21,39.68 180 bottom
R35  20.31,36.19 180 bottom
R49  22.89,62.2 0 bottom
R50  23.04,58.4 0 bottom
R51  28.79,56 0 bottom
R52  23.04,53.9 0 bottom
R53  23.19,49.69 180 bottom
R54  23.44,45.59 0 bottom
R55  28.79,51.59 180 bottom
R56  35.44,47.29 180 bottom
R57  28.89,47.18 180 bottom
R58  35.44,55.88 180 bottom
R59  28.69,60.38 180 bottom
R60  35.24,60.38 180 bottom
R61  35.49,51.57 180 bottom
S1  24.48,14.15 0 top
S2  9.1,36 0 bottom
SD1  8.17,54.83 270 bottom
SV1  83.77,56.04 90 bottom
SV2  8.1,13.2 270 bottom
U4  2.44,34.07 0 top
U$1  45.86,31.14 0 top
U$2  30.61,28.36 270 top
U$3  46.19,15.47 0 top
U$4  30.16,40.56 270 top
U$5  5.12,42.23 0 top
X1  46.28,3.25 0 bottom
X2  57.99,56.09 180 top
X3  57.99,65.7 180 top

### Tracks (layer width: path | path; a pad name or v marks a point on that pad's centre or on a via)
1V2  (via drill 0.61)
  Top 0.254: v56.75,63.88 56.75,62.5 X3.15 | v74,62.25 74,18.25 v70,14.25
  Bottom 0.254: 64.75,13.62 61.12,13.62 61.12,10 C27.1 | 64.75,13.62 66.12,15 IC4.2 | v56.75,63.88 56.88,64 68.38,64 68.75,63.62 72.62,63.62 v74,62.25 | v70,14.25 69.38,13.62 64.75,13.62
1V8  (via drill 0.61)
  Top 0.254: v57.88,54.75 56.75,53.62 56.75,52.88 X2.15 | v73.12,30 v73.12,51.5
  Bottom 0.254: 69.31,26.19 67,28.5 IC3.2 | 69.31,26.19 C22.1 | v57.88,54.75 58.25,55.12 69.5,55.12 v73.12,51.5 | 69.31,26.19 v73.12,30
2V8  (via drill 0.61)
  Top 0.254: 53.5,56.75 53.5,61.38 53.75,61.62 53.75,62.38 X3.21 | 53.5,56.75 53.5,54.5 53.75,54.25 53.75,52.88 X2.21 | v65,26.75 65,27.38 65.62,28 C24.1 | 71.31,30.31 v67.62,26.62 67.62,16.75 | 71.31,30.31 72.12,31.12 72.12,38.5 71.12,39.5 C23.1 | v53.88,56.75 53.5,56.75 | v68.5,56.62 68.25,56.38 68.25,37.25 68,37 68,33.62 71.31,30.31 | v70,13 67.62,15.38 67.62,16.75 | v67.5,16.75 67.62,16.75
  Bottom 0.254: 67.5,16.5 65.38,16.5 64,15.12 IC4.3 | 67.5,16.5 83.75,16.5 83.75,9.88 C2.1 | 71.81,11.19 73.25,12.62 78.62,12.62 80,14 IC2.2 | 71.81,11.19 70.5,9.88 C28.1 | C15.1 62.38,24.75 61.38,25.75 61.38,28.5 64.75,28.5 IC3.3 64.75,28.38 65,28.38 v65,26.75 67.5,26.75 v67.62,26.62 | v53.88,56.75 60.25,56.75 60.38,56.88 68.25,56.88 v68.5,56.62 | v70,13 71.81,11.19 | v67.5,16.75 67.5,16.5
BOOT0  (via drill 0.61)
  Top 0.254: v42.88,40.62 42.88,39.25 U$1.94 | v44.75,40.75 45,41 45,47.5 v45.12,47.62
  Bottom 0.254: 45.12,46.62 44.12,46.62 R5.2 | 45.12,46.62 46.5,46.62 R6.2 | v42.88,40.62 43,40.75 v44.75,40.75 | 45.12,46.62 v45.12,47.62
BOOT1  (via drill 0.61)
  Top 0.254: v43.12,16.38 45.38,18.62 45.38,23.12 U$1.37
  Bottom 0.254: R1.2 38.75,17.62 42,17.62 R2.2 42,17.5 v43.12,16.38
CAPTURE  (via drill 0.61)
  Top 0.254: v37.62,24.25 37.62,25 37.75,25.12 U$1.25
  Bottom 0.254: S2.1 11.62,37.88 6.62,37.88 S2.2 6.5,37.88 6.25,37.62 4,37.62 3,36.62 3,29.5 7.75,29.5 R8.1 8.75,28.62 9.75,28.62 | 9.75,28.62 11.25,28.62 12,29.38 C30.1 | v37.62,24.25 37,24.88 11.25,24.88 9.75,26.38 9.75,28.62
D0  (via drill 0.61)
  Top 0.254: v51.38,52.62 51.62,52.88 51.62,57.38 51.5,57.5 51.5,58.88 51.62,59 51.62,68.88 60.12,68.88 61.62,67.38 61.62,65.88 61.25,65.5 61.25,62.5 X3.6 | v64.12,51.5 63.75,51.88 63.75,52.75 X2.1 | v56.38,51.38 56.38,45.12 57.12,44.38 57.73,44.38 58.21,43.89 58.21,34.29 57.46,33.54 57.22,33.54 56.88,33.2 56.88,31.12 53.88,31.12 U$1.63
  Bottom 0.254: v51.38,52.62 51.75,52.25 56.38,52.25 | 56.38,52.25 63.38,52.25 v64.12,51.5 | 56.38,52.25 v56.38,51.38
D1  (via drill 0.6, 0.61)
  Top 0.254: 64.5,50.62 65,51.12 65,51.88 64.38,52.5 64.38,57.38 64.5,57.5 64.5,63.5 62.5,63.5 62.25,63.25 62.25,62.5 X3.4 | 64.5,50.62 63.25,50.62 63.25,52.75 X2.2 | 64.12,35.62 v64,35.5 64,36.19 64.09,36.28 64.09,39.69 65.8,41.4 65.8,49.33 64.5,50.62 | U$1.64 53.88,31.62 56.25,31.62 56.25,33.22 57.03,34 57.2,34 57.3,34.1 57.35,34.1 57.63,34.37 57.63,35.25 v57.38,35.5
  Bottom 0.254: v57.38,35.5 v64,35.5
D2  (via drill 0.61)
  Top 0.254: X3.3 62.75,62.38 62.75,58.12 61.62,57 61.62,55.62 61.25,55.25 61.25,52.88 X2.6 61.25,52.75 61.25,52 60.75,51.5 60.75,46.12 61.12,45.75 61.12,45 60.75,44.62 60.75,43 v60,42.25 | v41.75,42.62 41.38,42.25 41.38,39.25 U$1.97
  Bottom 0.254: v41.75,42.62 42.12,42.25 v60,42.25
D3  (via drill 0.61)
  Top 0.254: v61.75,58.38 61.75,62.38 X3.5 61.75,62.5 61.75,64.5 v62.12,64.88 | v63.62,58.25 62.12,56.75 62.12,53.75 62.25,53.62 62.25,52.88 X2.4 | v41.25,44.38 40.88,44 40.88,39.25 U$1.98 | v38.62,52 v38.62,44.38 | v47.25,52 47.88,52.62 47.88,60.75 v50.75,63.62
  Bottom 0.254: v61.75,58.38 61.88,58.25 v63.62,58.25 | v38.62,44.38 v41.25,44.38 | v38.62,52 39,52.38 46.88,52.38 v47.25,52 | v50.75,63.62 52,64.88 v62.12,64.88
D4  (via drill 0.61)
  Top 0.254: v60.75,66.25 60.75,62.5 X3.7 | v37.5,60.88 35.62,59 35.62,53.38 | 35.62,53.38 35.62,37.5 37,36.12 37.75,36.12 U$1.3 | v63,54.25 62.75,54 62.75,52.88 X2.3 | 35.62,53.38 v35.25,53.38
  Bottom 0.254: v60.75,66.25 59.88,65.38 49.12,65.38 47.38,63.62 40.25,63.62 v37.5,60.88 | v63,54.25 62.25,53.5 46,53.5 45.88,53.38 v35.25,53.38
D5  (via drill 0.61)
  Top 0.254: 61.75,51.62 61.75,52.75 X2.5 | 61.75,51.62 61.25,51.12 61.25,46.38 61.62,46 v61.62,43.5 | v43,44.38 43.88,43.5 43.88,39.25 U$1.92 | v59.75,68 59.75,62.5 X3.9 | v64.38,68 64.38,64.38 64.5,64.25 65,64.25 65,63.5 v65.38,63.12 | v72.25,50.62 v72.25,62.75 | 61.75,51.62 v61.75,50.62
  Bottom 0.254: v61.62,43.5 60,43.5 59.62,43.12 49.62,43.12 48.75,44 43.38,44 v43,44.38 | v64.38,68 v59.75,68 | v65.38,63.12 65.75,62.75 v72.25,62.75 | v61.75,50.62 v72.25,50.62
D6  (via drill 0.61)
  Top 0.254: v60.75,56 60.75,52.88 X2.7 | v34.38,54.25 34.38,38 36.75,35.62 37.75,35.62 U$1.4 | v58.38,66.25 58.75,65.88 58.75,62.5 X3.11 | v67.12,67.25 67.38,67 v67.38,56
  Bottom 0.254: v34.38,54.25 35.62,54.25 36,53.88 42.5,53.88 44.25,55.62 54,55.62 54.38,56 v60.75,56 v67.38,56 | v58.38,66.25 59.25,67.12 67,67.12 v67.12,67.25
D7  (via drill 0.61)
  Top 0.254: v58,58.12 58,60.25 57.75,60.5 57.75,62.38 X3.13 | v60.25,57.75 59.88,57.38 59.88,53.75 59.75,53.62 59.75,52.88 X2.9 | v39.38,35.12 37.88,35.12 U$1.5 | v42,35 43.25,33.75 43.25,27.12 43,26.88 43,26.12 v44.5,24.62
  Bottom 0.254: v58,58.12 58.38,57.75 v60.25,57.75 60.38,57.75 60.75,57.38 64,57.38 64.12,57.5 68.88,57.5 69.38,57 71.75,57 73.25,58.5 87.62,58.5 87.62,34.5 86.75,33.62 82,33.62 72,23.62 45.5,23.62 v44.5,24.62 | v39.38,35.12 39.5,35 v42,35
FPC_RX
  Bottom 0.254: X1.7 43.75,6.5 43.75,8.5 43.25,9 38,9 37.25,9.75 R30.1 37.12,9.88 32.5,9.88 32.5,13 33,13.5 37.12,13.5 R33.1
FPC_TX
  Bottom 0.254: R32.1 43.75,13.38 43.75,9.88 R31.1 43.88,9.75 44.38,9.25 44.75,9.25 44.75,6.5 X1.6
GND  (via drill 0.61)
  Top 0.254: C13.1 40.75,11.38 44.88,11.38 C12.1 45,11.25 47.12,11.25 | C10.1 53.25,11.12 49.25,11.12 C11.1 49.12,11.25 47.12,11.25 | 50.75,6.62 49.25,6.62 C7.1 49.12,6.75 47.12,6.75 | 50.75,6.62 53.38,6.62 C6.1 | v50.75,6.5 50.75,6.62 | 47.12,6.75 45,6.75 C8.1 44.88,6.75 40.75,6.75 C9.1 40.62,6.75 v37.62,6.75 | 47.12,6.75 47.12,11.25 | 65.5,37.75 65.5,34.88 66.38,34 C29.1 66.38,33.88 67.38,32.88 67.38,28.12 C24.2 67.5,27.88 64.5,24.88 64.5,22.38 61.5,19.38 61.38,19.38 | 65.5,37.75 65.5,38.62 66.38,39.5 R4.2 | 61.38,19.38 61.38,18.38 C5.2 61.5,18.25 61.5,14.12 v62.88,12.75 62.88,12.25 v67.25,7.88 | 61.38,19.38 61.38,22.25 C14.2 61.38,22.38 61.62,22.62 61.62,26.12 | C26.1 61.62,31.62 61.62,26.12 | 61.62,26.12 v62.25,26.12 | 71,36.62 71,37.62 C23.2 | 71,36.62 C25.1 | v52.38,37 52.38,36.62 53.75,36.62 U$1.74 | v70.12,36.62 71,36.62 | SV1.8 85.12,59.75 86.25,58.62 86.25,38.38 85.25,37.38 JP1.4 | v65.12,37.75 65.5,37.75 | 29.88,32.38 29.88,31.25 C17.1 29.88,31.12 29.25,30.5 29.25,22.12 29.62,21.75 C16.1 29.75,21.62 31.62,19.75 31.62,17.62 | 29.88,32.38 29.88,34.88 29,35.75 C18.1 28.88,35.88 28.88,43 C3.1 29,43.12 31.25,45.38 v31.25,45.5 | 29.88,32.38 33.62,32.38 33.88,32.62 37.75,32.62 U$1.10 | U$1.20 37.88,27.62 40.38,27.62 40.38,23.25 U$1.27 40.38,23.12 v40.38,16.62 | 31.62,17.62 31.62,14.25 30.88,13.5 C4.2 30.75,13.38 27.12,13.38 27.12,12.25 S1.4 27,12.25 22,12.25 S1.3 | v31.75,17.62 31.62,17.62 | 7.75,26.75 7.75,22.38 8,22.12 SV2.1 | 7.75,26.75 2.5,32 2.5,32.8 | 2.5,32.8 2.5,34 U4.GND | 16.81,28.56 16.12,29.25 16.12,30.5 C21.1 | 16.81,28.56 18.31,27.06 | 18.31,27.06 20,25.38 C20.1
  Top 0.254: 20.5,30.62 19.62,30.62 IC1.2 | 20.5,30.62 22.38,30.62 22.88,31.12 22.88,35.5 23.38,36 C19.1 | 18.31,27.06 20.5,29.25 20.5,30.62 | X2.10 59.25,52.88 59.25,57.38 59.38,57.5 59.38,60.5 59.5,60.62 59.5,61.38 59.25,61.62 59.25,62.38 X3.10 59.25,62.5 59.25,66.62 v58.25,67.62 | 52.75,58.5 52.75,62.38 X3.23 | 52.75,58.5 52.75,52.88 X2.23 | U$1.99 40.38,39.25 40.38,46 v40.5,46.12 40.5,57.75 v41.25,58.5 41.25,63.62 47.38,63.62 48.25,64.5 48.25,66.12 v49.75,67.62 | v52.38,58.5 52.75,58.5 | 16.81,28.56 16.12,27.88 v16.12,27.75 | v10.62,26.75 7.75,26.75 | U4.GND1 5.11,32.8 2.5,32.8
  Bottom 0.254: X1.1 v50.75,6.5 50.88,6.5 52.62,8.25 67.25,8.25 | IC4.1 68.5,15.12 69.12,15.75 80.62,15.75 82.25,14.12 IC2.1 82.25,14 82,14 C2.2 81.88,9.88 77.25,9.88 C1.2 77.12,9.88 75.5,8.25 67.25,8.25 | C28.2 68.62,9.88 63,9.88 C27.2 62.88,10 v62.88,12.75 | C22.2 69,24.62 64.25,24.62 C15.2 64.12,24.75 62.75,26.12 v62.25,26.12 | v52.38,37 53.25,37.88 65.12,37.88 | 65.12,37.88 68.88,37.88 69.75,37 69.75,36.62 | 69.75,36.62 69.75,28.62 69.38,28.62 IC3.1 | 69.75,36.62 v70.12,36.62 84.5,36.62 85.12,37.25 JP1.4 | v65.12,37.75 65.12,37.88 | v67.25,7.88 67.25,8.25 | v40.38,16.62 40.25,16.75 37.88,16.75 37,17.62 R1.1 36.88,17.62 v31.75,17.62 32,17.5 32,9.62 32.25,9.38 35,9.38 v37.62,6.75 | 13.25,62.62 5.38,62.62 SD1.S1 | 13.25,62.62 14.12,62.62 14.88,61.88 SD1.S4 | 12.88,28.88 12,28 C30.2 11.88,28 v10.62,26.75 | 12.88,34 12.88,28.88 | 12.88,34 11.75,34 S2.3 11.62,34.12 6.62,34.12 S2.4 | R5.1 42.25,46.62 41.75,46.12 v40.5,46.12 31.75,46.12 31.19,45.56 | 14.75,51.5 14.75,47.75 14.88,47.62 14.88,46.88 SD1.S3 | 14.75,51.5 15.75,51.5 SD1.6 | 12.88,47 14.75,47 SD1.S3 | 12.88,47 5.38,47 SD1.S2 | 31.19,45.56 30.38,44.75 17,44.75 15,46.75 SD1.S3 | v41.25,58.5 v52.38,58.5 | v49.75,67.62 v58.25,67.62 | 12.88,47 12.88,34 | 13.25,62.62 13.25,51.62 14.75,51.62 14.75,51.5 | v16.12,27.75 15,28.88 12.88,28.88 | v31.25,45.5 31.19,45.56
  pour Top: -4.3,93.5 94.9,93.5 94.9,-2 -4.3,-2
  pour Bottom: -4.3,93.5 94.8,93.5 94.8,-1.9 -4.3,-1.9
HREF  (via drill 0.61)
  Top 0.254: 56.25,57.62 56.25,62.38 X3.16 | 56.25,57.62 56.25,52.88 X2.16 | v41.75,21 41.38,21.38 41.38,23.12 U$1.29 | v28.5,21.62 27,23.12 27,35.75 26.62,36.12 26.62,41.5 28,42.88 28,54 v30.88,56.88 | 56.25,57.62 v56.62,57.62
  Bottom 0.254: v41.75,21 41.12,21.62 v28.5,21.62 | v30.88,56.88 31,56.75 48.25,56.75 48.38,56.62 52.5,56.62 53.5,57.62 v56.62,57.62
LCD_BLK  (via drill 0.61)
  Top 0.254: v52.38,28.25 52.38,30.12 53.75,30.12 U$1.61
  Bottom 0.254: v52.38,28.25 49.62,25.5 43.62,25.5 41.5,23.38 7,23.38 5.62,22 5.62,6.88 8,6.88 SV2.7
LCD_DC  (via drill 0.61)
  Top 0.254: v55.38,30 55.38,29.62 53.88,29.62 U$1.60 | v24,28.62 22.38,27 22.38,24 10,11.62 10,11.38 8.12,9.5 SV2.6
  Bottom 0.254: v55.38,30 54.5,29.12 37.5,29.12 37,28.62 v24,28.62
LCD_RES  (via drill 0.61)
  Top 0.254: v56.12,29 56.12,29.12 53.88,29.12 U$1.59 | v57.12,24.5 55.88,23.25 v55.88,18.38
  Bottom 0.254: v56.12,29 56.12,26.5 56.62,26.5 57.12,26 v57.12,24.5 | v55.88,18.38 55.5,18.75 43.38,18.75 42,20.12 9.88,20.12 9.25,20.75 6.88,20.75 6.12,20 6.12,12 8,12 SV2.5
MCU_3V3  (via drill 0.61)
  Top 0.254: v57.12,59.88 57.25,60 57.25,62.38 X3.14 | v18.12,35.88 18.12,36.5 18.5,36.88 D1.1 | C26.2 61,35 61,38.38 62,39.38 R3.2 62.12,39.5 62.5,39.88 v62.5,46.25 | v44.12,45.25 44.12,46 43.62,46.5 R11.2 43.5,46.62 43.5,51.5 | v47.5,45.38 47.5,46.12 48.12,46.75 R10.2 | 43.5,51.5 43.5,55.12 v43,55.62 v43,59.38 | v57.25,47 57.25,52.75 X2.14 | v53.88,46.62 53.88,37.25 U$1.75 | v43.38,51.5 43.5,51.5 | 51.88,8.25 53.38,8.25 C6.2 53.38,8.38 54.12,9.12 v54.12,16.62 | 51.88,8.25 49.25,8.25 C7.2 | 51.88,8.25 v51.88,8.75 | JP1.1 85.12,29.62 85.12,23.75 v76.25,14.88 v76.25,11.75 | v6.88,24.25 6.12,23.5 6.12,21.5 8,19.62 SV2.2 | v20.75,18.12 20.75,19 21,19.25 R7.2 | 39,28.12 40.88,28.12 40.88,23.25 U$1.28 40.88,23.12 40.88,17.38 42.75,15.5 45.12,15.5 45.12,16.75 v45.25,16.75 46.12,15.88 U$3.1 46.25,15.88 49.62,19.25 51.88,19.25 51.88,23.12 U$1.50 | 39,28.12 37.88,28.12 U$1.19 | 39,28.12 39,31.75 | 39,31.75 39,32.12 37.88,32.12 U$1.11 | v36.38,34.62 37.75,34.62 U$1.6 | 39,31.75 39.12,31.75 40.25,32.88 v40.25,34.12 40.25,35.5 39.88,35.88 39.88,39.12 U$1.100 39.75,39.25 39.75,45 v39.5,45.25 | 42.88,8.25 44.88,8.25 C8.2 | 42.88,8.25 40.75,8.25 C9.2 40.75,8.38 38,11.12 v38,14.75 | v42.88,8.12 42.88,8.25
  Bottom 0.254: R59.2 29.62,60.5 30.38,61.25 35.25,61.25 36,60.5 R60.2 36.12,60.25 36.38,60 43,60 | 43,60 57,60 v57.12,59.88 82.5,59.88 SV1.7 | 33,48.12 35.5,48.12 36.25,47.38 R56.2 | 33,48.12 30.62,48.12 29.75,47.25 R57.2 29.62,47.25 26.12,50.75 21.38,50.75 21.38,52 21.88,52.5 26.12,52.5 26.12,53.75 25.12,54.75 21.5,54.75 20.88,54.12 16.25,54.12 15.88,53.75 SD1.4 | 33,48.12 33,48.25 36.25,51.5 R61.2 36.38,51.5 36.75,51.12 40.75,51.12 41.38,51.75 43.12,51.75 v43.38,51.5 | R35.1 19.38,36.12 18.38,36.12 v18.12,35.88 18.38,36.25 14.25,36.25 14.25,38.25 14.75,38.75 18.38,38.75 19.25,39.62 R34.1 19.38,39.75 23.88,44.25 37.25,44.25 38.25,45.25 v39.5,45.25 v44.12,45.25 44.62,45.75 47.25,45.75 | 47.25,45.75 48.12,46.62 R6.1 48.25,46.75 53.88,46.75 | v47.5,45.38 47.25,45.62 47.25,45.75 | v43,55.62 36.62,55.62 36.38,55.88 R58.2 | 53.88,46.75 57,46.75 v57.25,47 61.75,47 v62.5,46.25 | v53.88,46.62 53.88,46.75 | v43,59.38 43,60 | v51.88,8.75 74.25,8.75 C1.1 75.5,10 75.5,11.75 v76.25,11.75 | v76.25,14.88 77,14.88 77.75,14.12 IC2.3 | v6.88,24.25 6.88,28.5 R8.2 | SV2.2 8.12,19.5 19.38,19.5 v20.75,18.12 20.88,18.12 21.25,18.5 42.88,18.5 43.62,17.75 R2.1 43.75,17.62 44.62,16.75 | v36.38,34.62 36.88,34.12 v40.25,34.12 | v42.88,8.12 42.88,6.5 X1.8 | 44.62,16.75 v45.25,16.75 54,16.75 v54.12,16.62 | v38,14.75 38.75,15.5 43.5,15.5 44.62,16.62 44.62,16.75
N$1  (via drill 3.3)
  other vias: 64.91,4.1
N$2  (via drill 0.61)
  Top 0.254: v36.5,39.12 37.75,37.88 37.75,37.25 U$1.1
  Bottom 0.254: v36.5,39.12 26.25,39.12 25.75,39.62 D3.C
N$3  (via drill 0.61)
  Top 0.254: v27.5,36.5 28,37 v28,38.25 | v38.62,38.25 39,37.88 39,36.88 38.75,36.62 37.88,36.62 U$1.2
  Bottom 0.254: v27.5,36.5 26.12,36.5 26,36.38 D4.C | v38.62,38.25 v28,38.25
N$6
  Bottom 0.254: R49.2 22,62.12 17,57.12 15.88,57.12 SD1.1
N$10
  Bottom 0.254: D3.A 23.88,39.75 21.12,39.75 R34.2
N$11  (via drill 0.61)
  Top 0.254: v59.62,20.12 59.62,18.62 59.88,18.38 C5.1 | v51,20.12 51.38,20.5 51.38,23.12 U$1.49
  Bottom 0.254: v59.62,20.12 59.25,20.5 51.38,20.5 v51,20.12
N$12  (via drill 0.61)
  Top 0.254: v61.88,36.38 63.12,35.12 63.12,33.12 61.62,33.12 61.12,32.62 61.12,23.62 59.88,22.38 C14.1 | v55.38,37 55,36.62 55,36.38 54.75,36.12 53.88,36.12 U$1.73
  Bottom 0.254: v61.88,36.38 61.25,37 v55.38,37
N$14
  Bottom 0.254: D4.A 24.12,36.25 21.25,36.25 R35.2
N$18
  Top 0.254: C20.2 21.62,25.38 21.75,25.5 21.75,29.62 IC1.4
N$25
  Top 0.254: U4.D-1 5.22,34.8 7,34.8 8.81,36.61 R26.2
N$30
  Top 0.254: D1.2 18.62,39.25 21.75,36.12 C19.2 21.88,36 21.88,31.62 IC1.5
N$31
  Top 0.254: R27.2 8.75,34.25 6.12,34.25 6,34.12 5.25,34.12 U4.D+1
N$32
  Top 0.254: U4.VBUS1 5.27,35.5 6.7,35.5 6.7,41 U$5.1
N$33
  Top 0.254: U4.ID1 6.17,33.42 R29.2
N$34
  Top 0.254: U$5.2 6.88,42.62 8.5,42.62 R28.2
N$46  (via drill 3.3)
  other vias: 27.91,4.1
N$51
  Bottom 0.254: R50.2 22.12,58.38 19.75,56 15.88,56 SD1.2
N$52
  Bottom 0.254: R51.2 27.88,56 27.12,55.25 16.75,55.25 16.38,54.88 15.88,54.88 SD1.3
N$53
  Bottom 0.254: R52.2 22.12,53.88 21,52.75 15.88,52.75 SD1.5
N$54
  Bottom 0.254: R53.1 22.25,49.75 21.75,50.25 16,50.25 15.88,50.38 SD1.7
N$55
  Bottom 0.254: R54.2 22.5,45.62 22.5,48.75 19.62,48.75 19.12,49.25 15.88,49.25 SD1.8
N$56  (via drill 0.61)
  Top 0.254: v18.88,48.25 v22.25,51.62
  Bottom 0.254: v22.25,51.62 27.88,51.62 R55.1 | v18.88,48.25 15.88,48.25 SD1.9
NRF24_CE
  Top 0.254: U$1.55 53.88,27.12 58.75,27.12 58.75,15.12 66.88,7 75.38,7 75.38,24.5 82,31.12 82,50.12 83.88,52 83.88,56.12 85,57.25 SV1.6
NRF24_CS  (via drill 0.61)
  Top 0.254: v45.5,34 45.88,34.38 45.88,39.12 U$1.88 | v58.62,32.88 59.12,33.38 v59.12,48.75
  Bottom 0.254: v45.5,34 53.62,34 55,32.62 57.12,32.62 57.38,32.88 v58.62,32.88 | v59.12,48.75 60.12,49.75 75,49.75 82.5,57.25 SV1.5
NRF24_IRQ  (via drill 0.61)
  Top 0.254: v60.5,39.5 60.5,28.12 53.88,28.12 U$1.57
  Bottom 0.254: v60.5,39.5 65.5,44.5 74.88,44.5 82.5,52.12 SV1.1
NRF24_MISO  (via drill 0.61)
  Top 0.254: v44.88,36.62 44.88,39.12 U$1.90 | v48.88,36.62 49.75,35.75 49.75,26.38 51.88,24.25 52.75,24.25 v52.75,19.62 | v82.88,32 83.38,32.5 83.38,50.5 85,52.12 SV1.2
  Bottom 0.254: v48.88,36.62 v44.88,36.62 | v52.75,19.62 53.12,19.25 70.12,19.25 v82.88,32
NRF24_MOSI  (via drill 0.61)
  Top 0.254: v42.88,21.62 42.88,23.12 U$1.32 | v81.12,31.5 81.38,31.75 81.38,53.62 82.5,54.75 SV1.3
  Bottom 0.254: v42.88,21.62 43.5,21 63.12,21 64.12,20 69.62,20 v81.12,31.5
NRF24_SCK  (via drill 0.61)
  Top 0.254: v40.88,37.62 41.12,37.38 41.12,32 41.88,31.25 41.88,23.25 U$1.30 | v37.75,40.75 36.5,42 v36.5,48.62
  Bottom 0.254: v37.75,40.75 v40.88,37.62 | v36.5,48.62 36.62,48.5 46,48.5 46.62,47.88 76.5,47.88 82.25,53.62 83.88,53.62 85,54.75 SV1.4
NRST  (via drill 0.61)
  Top 0.254: C4.1 30.75,15 27.12,15 27.12,16 S1.2 27,16.12 22,16.12 S1.1 21.88,16.12 21.5,16.12 20.81,16.81 | 20.81,16.81 19.88,17.75 19.88,18.75 19.38,19.25 R7.1 | v36.38,30 36.38,30.62 37.75,30.62 U$1.14 | v34.62,30 34.25,29.62 34.25,12.25 33.5,11.5 20.75,11.5 20.75,16.75 20.81,16.81
  Bottom 0.254: v34.62,30 v36.38,30
OSC32_IN  (via drill 0.61)
  Top 0.254: C3.2 30.38,43 30.25,42.88 30.25,40.62 U$4.1 30.25,40.5 32.38,38.38 32.38,34.12 v33.25,33.25 | v39.38,33.25 39.38,33.62 37.88,33.62 U$1.8
  Bottom 0.254: v33.25,33.25 v39.38,33.25
OSC32_OUT  (via drill 0.61)
  Top 0.254: U$4.2 30.25,38 30.25,36 30.38,35.88 C18.2 30.38,36.12 v31.5,35 | v35,34.12 35,33.12 37.75,33.12 U$1.9
  Bottom 0.254: v35,34.12 34.12,35 v31.5,35
OSC_IN
  Top 0.254: U$2.1 30.62,28.38 30.62,30.38 31.38,31.12 C17.2 31.5,31.25 31.5,31.75 33.88,31.75 34,31.62 37.75,31.62 U$1.12
OSC_OUT  (via drill 0.61)
  Top 0.254: C16.2 31.12,21.75 30.62,22.25 30.62,24.62 U$2.2 30.75,24.62 v32.38,26.25 | v35.12,26.5 35.5,26.88 35.5,31.12 37.75,31.12 U$1.13
  Bottom 0.254: v35.12,26.5 34.88,26.25 v32.38,26.25
OTG_FS_DM  (via drill 0.61)
  Top 0.254: v15.12,37.88 10.62,37.88 R26.1 | v51.12,36.62 51.5,36.25 51.5,35.38 52.25,34.62 53.75,34.62 U$1.70
  Bottom 0.254: v15.12,37.88 15.62,37.38 39.88,37.38 40.5,36.75 43.75,36.75 44.5,37.5 50.25,37.5 v51.12,36.62
OTG_FS_DP  (via drill 0.61)
  Top 0.254: v15.12,33.25 15.12,34.25 10.5,34.25 R27.1 | v46.88,28.12 48,29.25 v48,35.75 | v52.38,35.75 53,35.12 53.75,35.12 U$1.71
  Bottom 0.254: v15.12,33.25 20.62,27.75 26.62,27.75 27,28.12 v46.88,28.12 | v52.38,35.75 v48,35.75
OTG_FS_ID  (via drill 0.6, 0.61)
  Top 0.254: v14.38,30.75 10.5,30.75 R29.1 | v43.88,26.5 44.25,26.88 v44.25,34 | U$1.69 53.88,34.12 54.75,34.12 55,34.38 55.98,34.38 56.1,34.25 v56.51,34.66
  Bottom 0.254: v14.38,30.75 19.75,25.38 42.75,25.38 v43.88,26.5 | v44.25,34 45.12,34.88 55,34.88 56.01,35.89 56.51,35.39 v56.51,34.66
OV_PWDN  (via drill 0.61)
  Top 0.254: v67.38,52.5 67.38,38.75 66.5,37.88 R4.1 | v69.12,54.25 69.38,54.5 69.38,58.38 68.25,59.5 v68.25,60.75 | v55.5,63.88 55.75,63.62 55.75,62.5 X3.17 55.75,62.38 55.75,52.88 X2.17
  Bottom 0.254: v69.12,54.25 v67.38,52.5 | v68.25,60.75 66.75,62.25 57.12,62.25 v55.5,63.88
OV_RESET  (via drill 0.61)
  Top 0.254: 54.75,59 54.75,62.38 X3.19 | 54.75,59 54.75,56.38 54,55.62 54,54.75 54.75,54 54.75,52.88 X2.19 | v63.25,36.62 62.12,37.75 R3.1 | C25.2 71,32.25 70,33.25 70,35.5 v68.88,36.62 68.88,36.75 70,37.88 v70,59 | v54.38,59 54.75,59
  Bottom 0.254: v68.88,36.62 v63.25,36.62 | v54.38,59 61.12,59 61.38,59.25 69.75,59.25 v70,59
PCLK  (via drill 0.61)
  Top 0.254: v42.38,32 42.38,23.25 U$1.31 | v65,32 65,32.12 65.12,32.25 66.38,32.25 C29.2 | v60.25,45.38 60.25,52.75 X2.8 | v60.38,60.75 60.25,60.88 60.25,62.38 X3.8 | v66.5,58.38 v66.5,60.75 | v71.38,57.88 71,57.5 71,45.75 v71.38,45.38 | v57.75,32 57.75,33.19 58.28,33.71 58.38,33.71 58.67,34 58.67,44.08 v57.38,45.38
  Bottom 0.254: v42.38,32 55.38,32 55.75,31.62 57.75,31.62 | 57.75,31.62 63.25,31.62 63.62,32 v65,32 | v57.38,45.38 v60.25,45.38 v71.38,45.38 | 57.75,31.62 v57.75,32 | v60.38,60.75 60.75,60.38 66.12,60.38 v66.5,60.75 | v66.5,58.38 69.38,58.38 69.88,57.88 v71.38,57.88
SD_CD  (via drill 0.61)
  Top 0.254: v51.25,51.38 52.88,49.75 52.88,38 51.25,38 50.25,37 50.25,26.62 53.75,26.62 U$1.54
  Bottom 0.254: R55.2 29.75,51.62 34.62,51.62 R61.1 34.75,51.62 36,52.88 49.75,52.88 v51.25,51.38
SD_CLK  (via drill 0.61)
  Top 0.254: v25.25,53.38 27,51.62 v27,43.12 | v49.25,40.62 49.88,40 49.88,39.25 U$1.80
  Bottom 0.254: v25.25,53.38 24.5,53.38 24,53.88 R52.1 | v27,43.12 28.5,41.62 48.25,41.62 v49.25,40.62
SD_CMD  (via drill 0.61)
  Top 0.254: v48.38,43.12 48.38,39.25 U$1.83 | v37.75,43.5 37.38,43.88 v37.38,54.75
  Bottom 0.254: R51.1 34.5,56 R58.1 34.62,55.75 35.38,55 37.12,55 v37.38,54.75 | v48.38,43.12 48,43.5 v37.75,43.5
SD_DAT0  (via drill 0.61)
  Top 0.254: v52.25,31.12 52.25,32.12 53.75,32.12 U$1.65 | v26.12,46.75 v26.12,33.25
  Bottom 0.254: 26.5,47.25 24.12,49.62 R53.2 | 26.5,47.25 28,47.25 R57.1 | v52.25,31.12 50.75,29.62 37.25,29.62 36.75,29.12 30.25,29.12 v26.12,33.25 | v26.12,46.75 26.5,47.12 26.5,47.25
SD_DAT1  (via drill 0.61)
  Top 0.254: v31.62,47.25 v30,45.62 | v51.12,28.25 51.12,31.75 51.88,32.5 51.88,32.62 53.75,32.62 U$1.66 | v26.12,26.88 24.88,28.12 v24.88,46.88
  Bottom 0.254: v30,45.62 24.88,45.62 | 24.88,45.62 24.38,45.62 R54.1 | v31.62,47.25 34.5,47.25 R56.1 | v51.12,28.25 50.12,27.25 44.38,27.25 44.25,27.38 27,27.38 26.5,26.88 v26.12,26.88 | 24.88,45.62 v24.88,46.88
SD_DAT2  (via drill 0.61)
  Top 0.254: v33.12,60.38 v31.38,62.12 | v51.25,49.62 50.88,49.25 50.88,39.25 U$1.78 | v39.62,50 39.5,50.12 v39.5,58.5
  Bottom 0.254: v31.38,62.12 23.75,62.12 R49.1 | v33.12,60.38 34.38,60.38 R60.1 34.5,60.38 35.38,59.5 38.5,59.5 v39.5,58.5 | v51.25,49.62 50.88,50 v39.62,50
SD_DAT3  (via drill 0.61)
  Top 0.254: v48.75,57.5 48.75,55.12 50.38,53.5 50.38,39.25 U$1.79
  Bottom 0.254: R50.1 24,58.5 25.88,60.38 27.75,60.38 R59.1 27.88,60.38 28.75,59.5 29.5,59.5 31.38,57.62 48.62,57.62 v48.75,57.5
SIO_CLK  (via drill 0.61)
  Top 0.254: v42.12,37.62 42.38,37.88 42.38,39.12 U$1.95 | v46.25,40.62 45.88,41 45.88,41.12 45.5,41.5 45.5,46.75 46.38,46.75 R10.1 46.5,46.75 47,46.75 v47,48.75 46.88,48.75 46.38,49.25 v46.38,62.25 | v54.62,48.75 54.25,49.12 54.25,52.75 X2.20 | v54.25,63.88 54.25,62.5 X3.20
  Bottom 0.254: v42.12,37.62 44.38,39.88 45.5,39.88 v46.25,40.62 | v47,48.75 v54.62,48.75 | v54.25,63.88 52.62,62.25 v46.38,62.25
SIO_DAT  (via drill 0.61)
  Top 0.254: v53,63.88 53.25,63.62 53.25,62.5 X3.22 | 42.12,50.88 42.12,46.5 R11.1 42.12,46.38 42.12,44 42.62,43.5 42.62,42.25 41.88,41.5 41.88,39.25 U$1.96 | 42.12,50.88 v42.12,62.75 | v53.25,50.88 53.25,52.75 X2.22 | 42.12,50.88 v41.75,50.88
  Bottom 0.254: v53,63.88 53,63.38 52.38,62.75 47.12,62.75 46.75,63.12 42.5,63.12 v42.12,62.75 | v53.25,50.88 52.88,50.5 42.12,50.5 v41.75,50.88
SPI2_CS  (via drill 0.61)
  Top 0.254: v48.88,14.5 53.75,19.38 53.75,25.12 U$1.51
  Bottom 0.254: v48.88,14.5 48.88,6.5 X1.2
SPI2_MISO  (via drill 0.61)
  Top 0.254: v46.62,5.12 43,1.5 34.62,1.5 | 34.62,1.5 8.12,1.5 8.12,4.25 SV2.8 | v35.88,3.88 36.12,4.12 36.12,29.12 37.75,29.12 U$1.17 | 34.62,1.5 v34.62,2.62
  Bottom 0.254: v46.62,5.12 46.75,5.12 46.75,6.5 X1.4 | v34.62,2.62 v35.88,3.88
SPI2_MOSI  (via drill 0.61)
  Top 0.254: 36.75,5.12 v44,5.12 | 36.75,5.12 36.75,28.5 36.88,28.62 37.75,28.62 U$1.18 | 36.75,5.12 36.75,3 35.5,3 35,3.5 35,8 7.12,8 6.12,9 6.12,12.5 8,14.38 SV2.4
  Bottom 0.254: v44,5.12 45.75,5.12 45.75,6.5 X1.5
SPI2_SCK  (via drill 0.61)
  Top 0.254: v55,7.38 55,25.62 53.88,25.62 U$1.52
  Bottom 0.254: 47.75,5.5 47.75,4.25 41.88,4.25 40.25,5.88 29.75,5.88 18.62,17 8.12,17 SV2.3 | 47.75,5.5 47.75,6.5 X1.3 | v55,7.38 53.12,5.5 47.75,5.5
SWTCK  (via drill 0.61)
  Top 0.254: v52,40.62 52,39.38 51.88,39.25 U$1.76
  Bottom 0.254: v52,40.62 54,38.62 86.25,38.62 87.12,37.75 87.12,34.75 JP1.3
SWTDIO  (via drill 0.6)
  Top 0.254: U$1.72 53.9,35.6 55.9,35.6 56.7,36.4 v56.7,40.5 | v63.6,44.2 63.6,42.5 v64.3,41.8 | v78.3,41.8 78.3,32.3 v76,30 | v72.4,26.5 v72.4,18.9
  Bottom 0.254: v56.7,40.5 59.9,40.5 v63.6,44.2 | v64.3,41.8 v78.3,41.8 | v76,30 75.9,30 v72.4,26.5 | v72.4,18.9 74.2,18.9 80.9,25.6 80.9,27.88 JP1.2
UART2_RX  (via drill 0.61)
  Top 0.254: v38.88,11.75 v40.75,9.88 40.62,10.12 v45.12,10.12 | v49.12,24.62 46,27.75 46,31.25 46.38,31.62 46.38,39.12 U$1.87 | v55.88,24.62 56.62,25.38 58,25.38 58,19.25 v55.88,17.12
  Bottom 0.254: v38.88,11.75 38.88,13.5 R33.2 | v40.75,9.88 42.12,9.88 R31.2 | v55.88,24.62 v49.12,24.62 | v55.88,17.12 54.12,15.38 48.5,15.38 45.12,12 v45.12,10.12
UART2_TX  (via drill 0.61)
  Top 0.254: v46.88,30.88 46.88,39.12 U$1.86 | v33.5,30.88 33.38,30.75 v33.38,12.62
  Bottom 0.254: 39.69,10.69 42,13 42,13.38 R32.2 | 39.69,10.69 38.88,9.88 R30.2 | v33.5,30.88 v46.88,30.88 | v33.38,12.62 35.25,10.75 39.62,10.75 39.69,10.69
VBUS  (via drill 0.61)
  Top 0.254: 18.5,32 19.5,32 19.5,31.62 IC1.1 | 18.5,32 16.12,32 C21.2 | R28.1 10.38,42.5 14.12,38.75 16,38.75 16,32.12 C21.2 | 18.5,32 18.5,29.75 19.5,29.75 IC1.3 | v55.38,33.5 55.38,33.62 53.88,33.62 U$1.68 | v64,33.75 63.62,33.38 v63.62,22.75 | v19.62,22.5 15.25,26.88 15.25,31.25 16,32 C21.2
  Bottom 0.254: v55.38,33.5 55.62,33.75 v64,33.75 | v63.62,22.75 63.38,22.5 v19.62,22.5
VDDA
  Top 0.254: U$1.21 37.88,27.12 37.88,26.75 U$1.22 38,26.75 39.12,26.75 39.12,14.62 40.75,13 C13.2 40.75,12.88 44.88,12.88 C12.2 45,12.88 45,13 46.94,14.94 | 46.94,14.94 47.75,15.75 U$3.2 | 46.94,14.94 49.12,12.75 C11.2 49.25,12.62 53.25,12.62 C10.2
VSYNC  (via drill 0.61)
  Top 0.254: 55.25,55.12 55.25,62.38 X3.18 | 55.25,55.12 55.25,52.88 X2.18 | v43.38,37.62 43.38,39.12 U$1.93 | v47.5,40.62 47.5,44.12 49.12,45.75 49.12,50.62 v48.38,51.38 | v45.5,54.25 v45.5,51.5 | 55.25,55.12 v54.88,55.12
  Bottom 0.254: v43.38,37.62 45.12,39.38 46.25,39.38 v47.5,40.62 | v48.38,51.38 48.12,51.12 45.88,51.12 v45.5,51.5 | v45.5,54.25 46.38,55.12 v54.88,55.12
XCLK  (via drill 0.61)
  Top 0.254: 58.69,61.19 58.25,61.62 58.25,62.38 X3.12 | 58.69,61.19 58.88,61 58.88,57.75 58.75,57.62 58.75,54.38 58.25,53.88 58.25,52.88 X2.12 | v51.12,33.12 53.75,33.12 U$1.67 | v35.38,35.75 35,36.12 35,36.62 33.5,38.12 33.5,58.12 37.12,61.75 v40.38,61.75 | v58.62,61 58.62,61.12 58.69,61.19
  Bottom 0.254: v51.12,33.12 43.88,33.12 42.88,34.12 42.88,36 35.62,36 v35.38,35.75 | v40.38,61.75 41.12,61 v58.62,61

### Text on the board
tPlace: Vision | OV2640 / OV7670 | 3V3 GND / CS CE / MOSI SCK / IRQ MISO | GND | SWTCK | SWDIO | 3V3 | GND | 3V3 | SCK | MOSI | RES | D/C | BLK | MISO | GROBO-Vision-v1.0 / 20190522